# EAGLE design SEQ (EAGLE 9.6.2)

## Sheet 1 of 3: SEQ_microcontrolleur
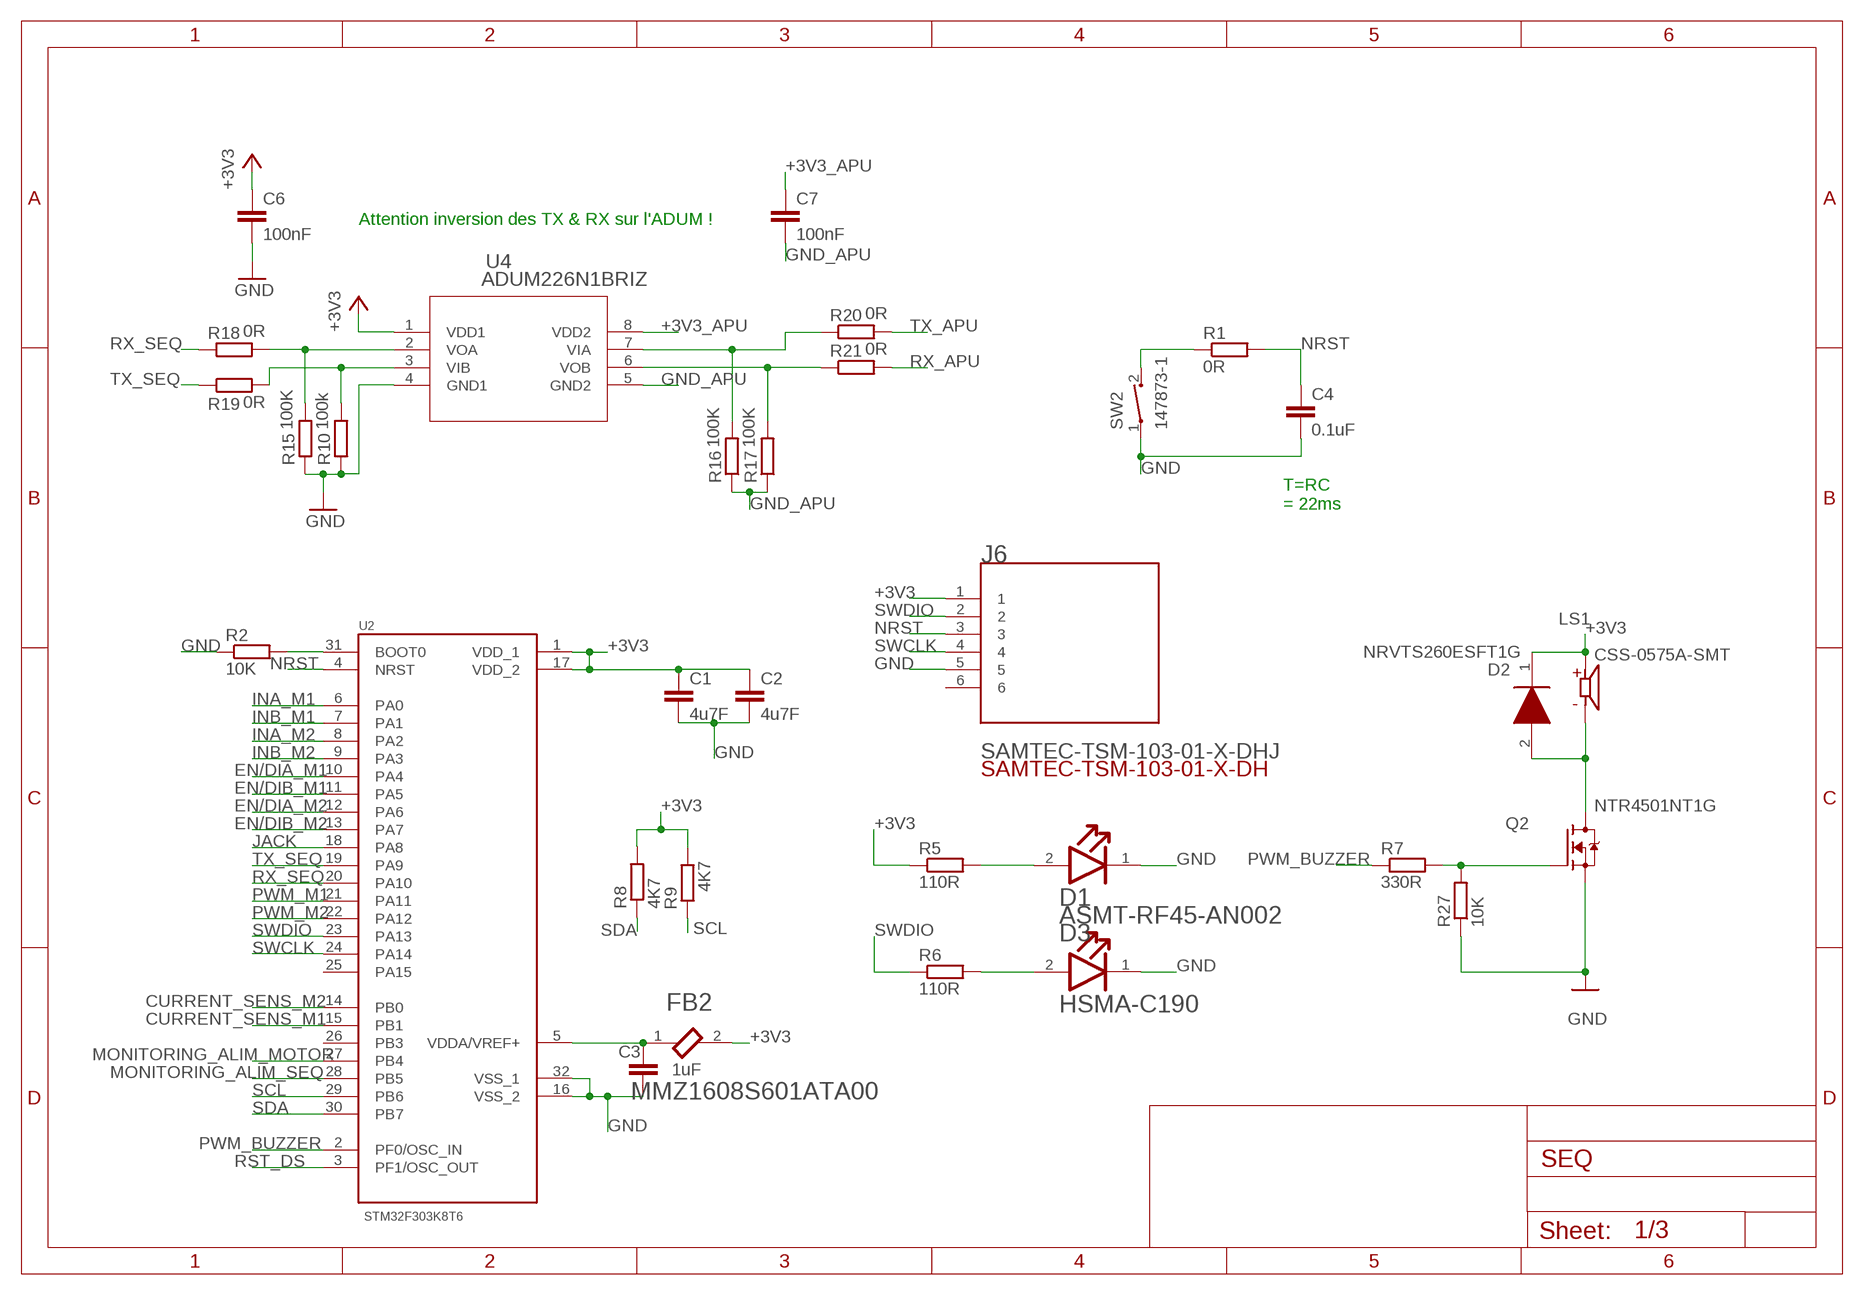
[diagram p0: schematic, sheet 1]

### Parts
C1  4u7F  C-EUC0805K  [C0805K]
C2  4u7F  C-EUC0805K  [C0805K]
C3  1uF  C-EUC0805K  [C0805K]
C4  0.1uF  C-EUC0805K  [C0805K]
C6  100nF  C-EUC0805  [C0805]
C7  100nF  C-EUC0805  [C0805]
D1  BROADCOM_ASMT-RF45-AN002BROADCOM_ASMT-RF45-AN002_0_0  [BROADCOM_ASMT-RF45-AN002_0]
D2  NRVTS260ESFT1G  [SODFL3616X98N]
D3  BROADCOM_HSMA-C190BROADCOM_HSMA-C190_0_0  [BROADCOM_HSMA-C190_0]
FB2  TDK_MMZ1608S601ATA00TDK_MMZ1608S601ATA00_0_0  [TDK_MMZ1608S601ATA00_0]
J6  SAMTEC-TSM-103-01-X-DHJ  [SAMTEC-TSM-103-01-X-DH]
LS1  CSS-0575A-SMT  [CUI_CSS-0575A-SMT]
Q2  NTR4501NT1G  [SOT95P237X111-3N]
R1  0R  R-EU_R0603  [R0603]
R2  10K  R-EU_R0603  [R0603]
R5  110R  R-EU_R0603  [R0603]
R6  110R  R-EU_R0603  [R0603]
R7  330R  R-EU_R0603  [R0603]
R8  4K7  R-EU_R0603  [R0603]
R9  4K7  R-EU_R0603  [R0603]
R10  100k  R-EU_R0603  [R0603]
R15  100K  R-EU_R0603  [R0603]
R16  100K  R-EU_R0603  [R0603]
R17  100K  R-EU_R0603  [R0603]
R18  0R  R-EU_R0603  [R0603]
R19  0R  R-EU_R0603  [R0603]
R20  0R  R-EU_R0603  [R0603]
R21  0R  R-EU_R0603  [R0603]
R27  10K  R-EU_R0603  [R0603]
SW2  147873-1  [SW_147873-1]
U2  STM32F303K8T6  [QFP80P900X900X160-32N]
U4  ADUM226N1BRIZ  [RI_8_1_ADI]

### Nets
+3V3: C1.1 C2.1 C6.1 D2.1(K) FB2.2 J6.1 LS1.1(P) R5.1 R8.2 R9.2 U2.1(VDD_1) U2.17(VDD_2) U4.1(VDD1) ; also sheet 2,3
+3V3_APU [Power]: C7.1 U4.8(VDD2) ; also sheet 3
CURRENT_SENS_M1: U2.15(PB1) ; also sheet 3
CURRENT_SENS_M2: U2.14(PB0) ; also sheet 3
EN/DIA_M1: U2.10(PA4) ; also sheet 3
EN/DIA_M2: U2.12(PA6) ; also sheet 3
EN/DIB_M1: U2.11(PA5) ; also sheet 3
EN/DIB_M2: U2.13(PA7) ; also sheet 3
GATE: Q2.1(G) R7.2 R27.2
GND: C1.2 C2.2 C3.2 C4.2 C6.2 D1.1(CATHODE) D3.1(CATHODE) J6.5 Q2.2(S) R2.1 R10.1 R15.1 R27.1 SW2.1 U2.16(VSS_2) U2.32(VSS_1) U4.4(GND1) ; also sheet 2,3
GND_APU: C7.2 R16.1 R17.1 U4.5(GND2) ; also sheet 2,3
INA_M1: U2.6(PA0) ; also sheet 3
INA_M2: U2.8(PA2) ; also sheet 3
INB_M1: U2.7(PA1) ; also sheet 3
INB_M2: U2.9(PA3) ; also sheet 3
JACK: U2.18(PA8) ; also sheet 3
MONITORING_ALIM_MOTOR: U2.27(PB4) ; also sheet 3
MONITORING_ALIM_SEQ: U2.28(PB5) ; also sheet 3
N$3 [Power]: C3.1 FB2.1 U2.5(VDDA/VREF+)
N$4: R2.2 U2.31(BOOT0)
N$6: R1.1 SW2.2
N$7: D1.2(ANODE) R5.2
N$9: D3.2(ANODE) R6.2
N$12 [50Ohms]: R10.2 R19.2 U4.3(VIB)
N$13 [50Ohms]: R15.2 R18.2 U4.2(VOA)
N$14 [50Ohms]: R16.2 R20.1 U4.7(VIA)
N$15 [50Ohms]: R17.2 R21.1 U4.6(VOB)
N$57: D2.2(A) LS1.2(N) Q2.3(D)
NRST: C4.1 J6.3 R1.2 U2.4(NRST)
PWM_BUZZER: R7.1 U2.2(PF0/OSC_IN)
PWM_M1: U2.21(PA11) ; also sheet 3
PWM_M2: U2.22(PA12) ; also sheet 3
RST_DS: U2.3(PF1/OSC_OUT) ; also sheet 2
RX_APU [50Ohms]: R21.2 ; also sheet 2,3
RX_SEQ [50Ohms]: R18.1 U2.20(PA10) ; also sheet 2
SCL [50Ohms]: R9.1 U2.29(PB6) ; also sheet 2,3
SDA [50Ohms]: R8.1 U2.30(PB7) ; also sheet 2,3
SWCLK [50Ohms]: J6.4 U2.24(PA14)
SWDIO [50Ohms]: J6.2 R6.1 U2.23(PA13)
TX_APU [50Ohms]: R20.2 ; also sheet 2,3
TX_SEQ [50Ohms]: R19.1 U2.19(PA9) ; also sheet 2
Unconnected: J6.6 U2.25(PA15) U2.26(PB3)

### Notes on the sheet
- Attention inversion des TX & RX sur l'ADUM !
- T=RC
  = 22ms

## Sheet 2 of 3: SEQ_capteur
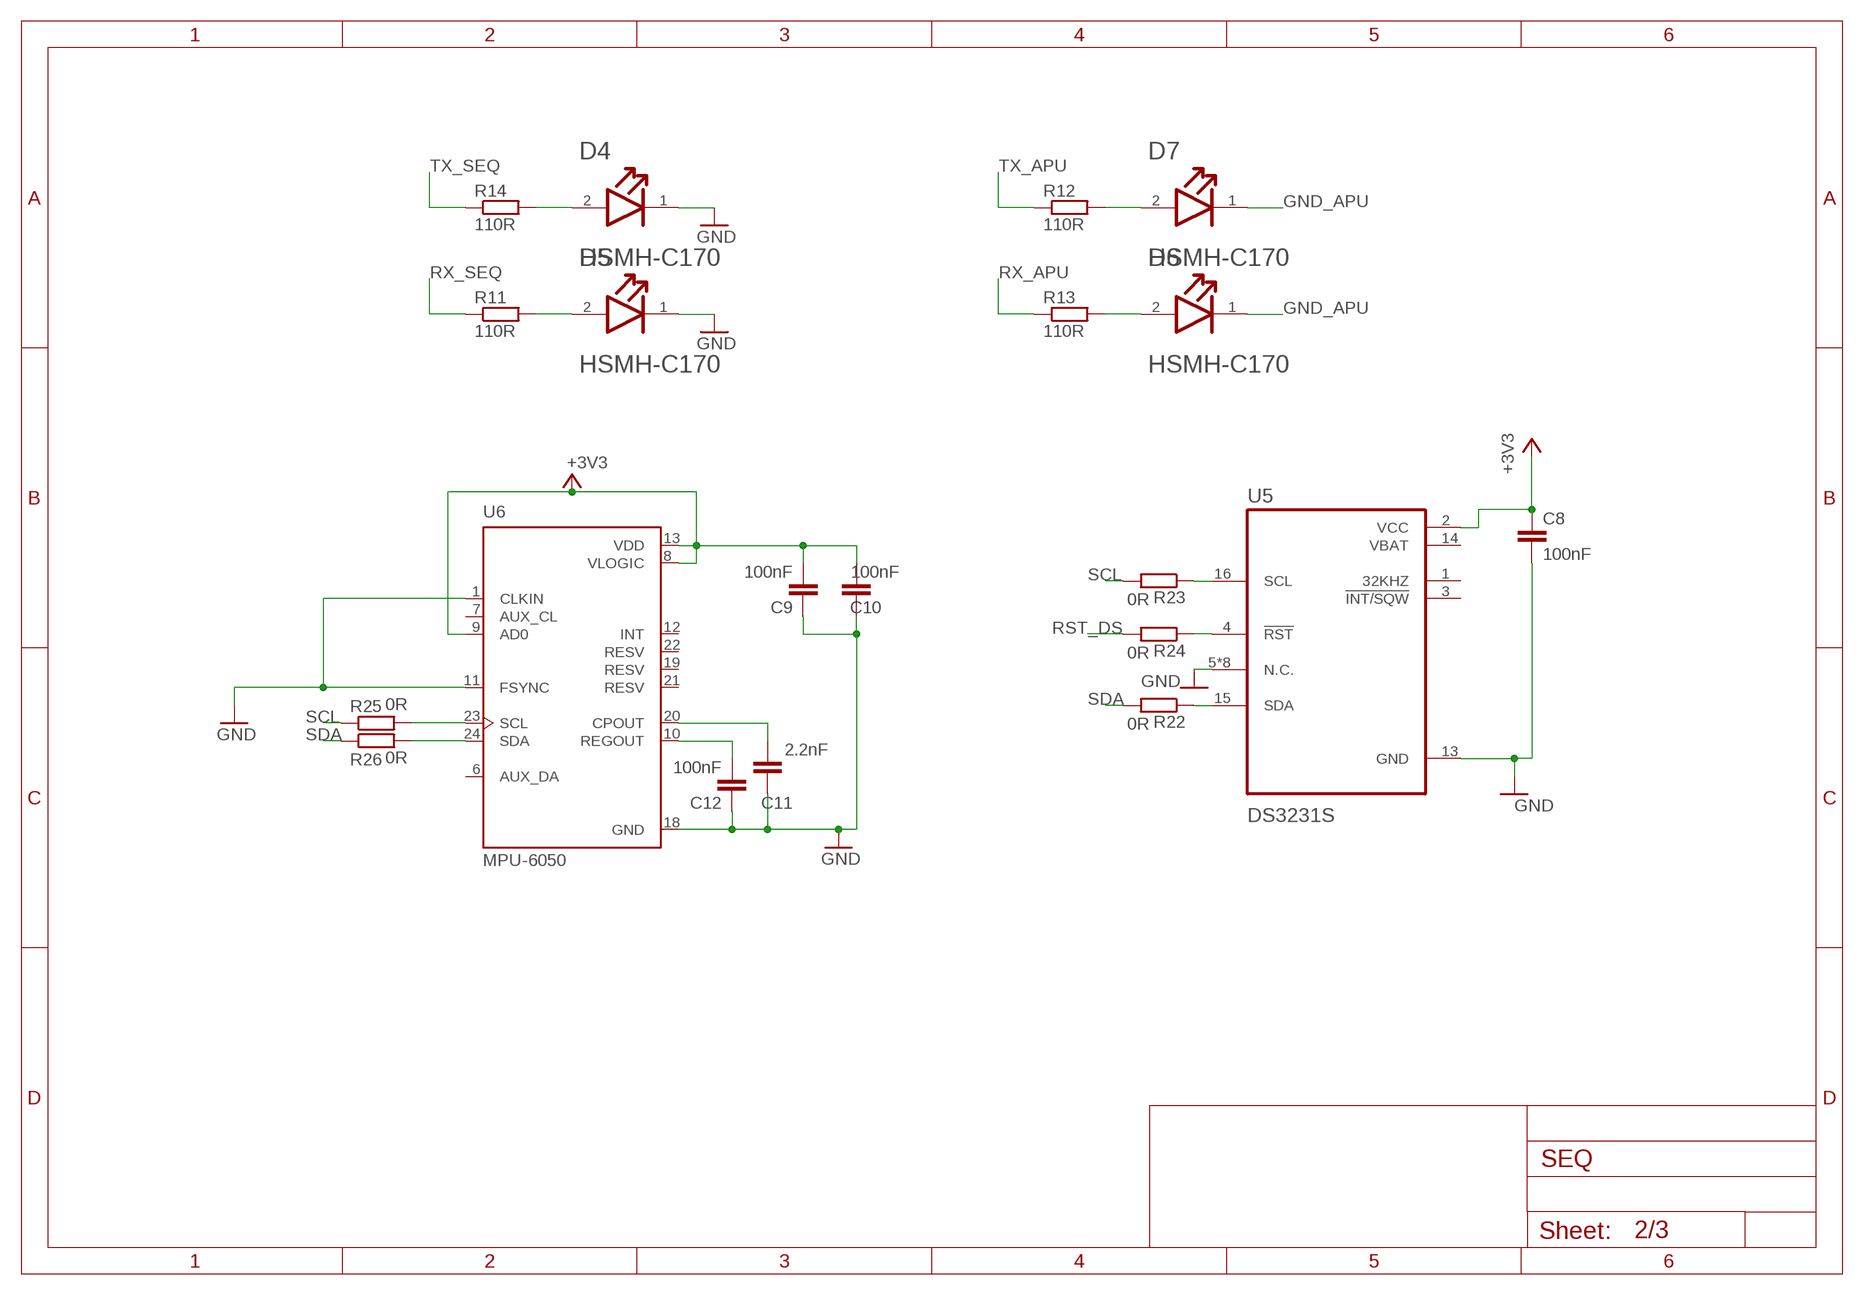
[diagram p1: schematic, sheet 2]

### Parts
C8  100nF  C-EUC0805  [C0805]
C9  100nF  C-EUC0805  [C0805]
C10  100nF  C-EUC0805  [C0805]
C11  2.2nF  C-EUC0805  [C0805]
C12  100nF  C-EUC0805  [C0805]
D4  BROADCOM_HSMH-C170BROADCOM_HSMH-C170_0_0  [BROADCOM_HSMH-C170_0]
D5  BROADCOM_HSMH-C170BROADCOM_HSMH-C170_0_0  [BROADCOM_HSMH-C170_0]
D6  BROADCOM_HSMH-C170BROADCOM_HSMH-C170_0_0  [BROADCOM_HSMH-C170_0]
D7  BROADCOM_HSMH-C170BROADCOM_HSMH-C170_0_0  [BROADCOM_HSMH-C170_0]
R11  110R  R-EU_R0603  [R0603]
R12  110R  R-EU_R0603  [R0603]
R13  110R  R-EU_R0603  [R0603]
R14  110R  R-EU_R0603  [R0603]
R22  0R  R-EU_R0603  [R0603]
R23  0R  R-EU_R0603  [R0603]
R24  0R  R-EU_R0603  [R0603]
R25  0R  R-EU_R0603  [R0603]
R26  0R  R-EU_R0603  [R0603]
U5  DS3231S  [SOIC127P1032X265-16N]
U6  MPU-6050  [QFN50P400X400X95-24N]

### Nets
+3V3: C8.1 C9.2 C10.2 U5.2(VCC) U6.8(VLOGIC) U6.9(AD0) U6.13(VDD) ; also sheet 1,3
GND: C8.2 C9.1 C10.1 C11.1 C12.1 D4.1(CATHODE) D5.1(CATHODE) U5.5(N.C.) U5.6(N.C.) U5.7(N.C.) U5.8(N.C.) U5.9(N.C.) U5.10(N.C.) U5.11(N.C.) U5.12(N.C.) U5.13(GND) U6.1(CLKIN) U6.11(FSYNC) U6.18(GND) ; also sheet 1,3
GND_APU: D6.1(CATHODE) D7.1(CATHODE) ; also sheet 1,3
N$1: D4.2(ANODE) R14.2
N$2: D5.2(ANODE) R11.2
N$8: D7.2(ANODE) R12.2
N$10: D6.2(ANODE) R13.2
N$16 [50Ohms]: R22.1 U5.15(SDA)
N$17 [50Ohms]: R23.1 U5.16(SCL)
N$18: R24.1 U5.4(!RST)
N$19 [50Ohms]: R26.2 U6.24(SDA)
N$20 [50Ohms]: R25.2 U6.23(SCL)
N$21: C12.2 U6.10(REGOUT)
N$22: C11.2 U6.20(CPOUT)
RST_DS: R24.2 ; also sheet 1
RX_APU [50Ohms]: R13.1 ; also sheet 1,3
RX_SEQ [50Ohms]: R11.1 ; also sheet 1
SCL [50Ohms]: R23.2 R25.1 ; also sheet 1,3
SDA [50Ohms]: R22.2 R26.1 ; also sheet 1,3
TX_APU [50Ohms]: R12.1 ; also sheet 1,3
TX_SEQ [50Ohms]: R14.1 ; also sheet 1
Unconnected: U5.1(32KHZ) U5.3(!INT/SQW) U6.6(AUX_DA) U6.7(AUX_CL) U6.12(INT) U6.19(RESV) U6.21(RESV) U6.22(RESV)

## Sheet 3 of 3: SEQ_connecteur
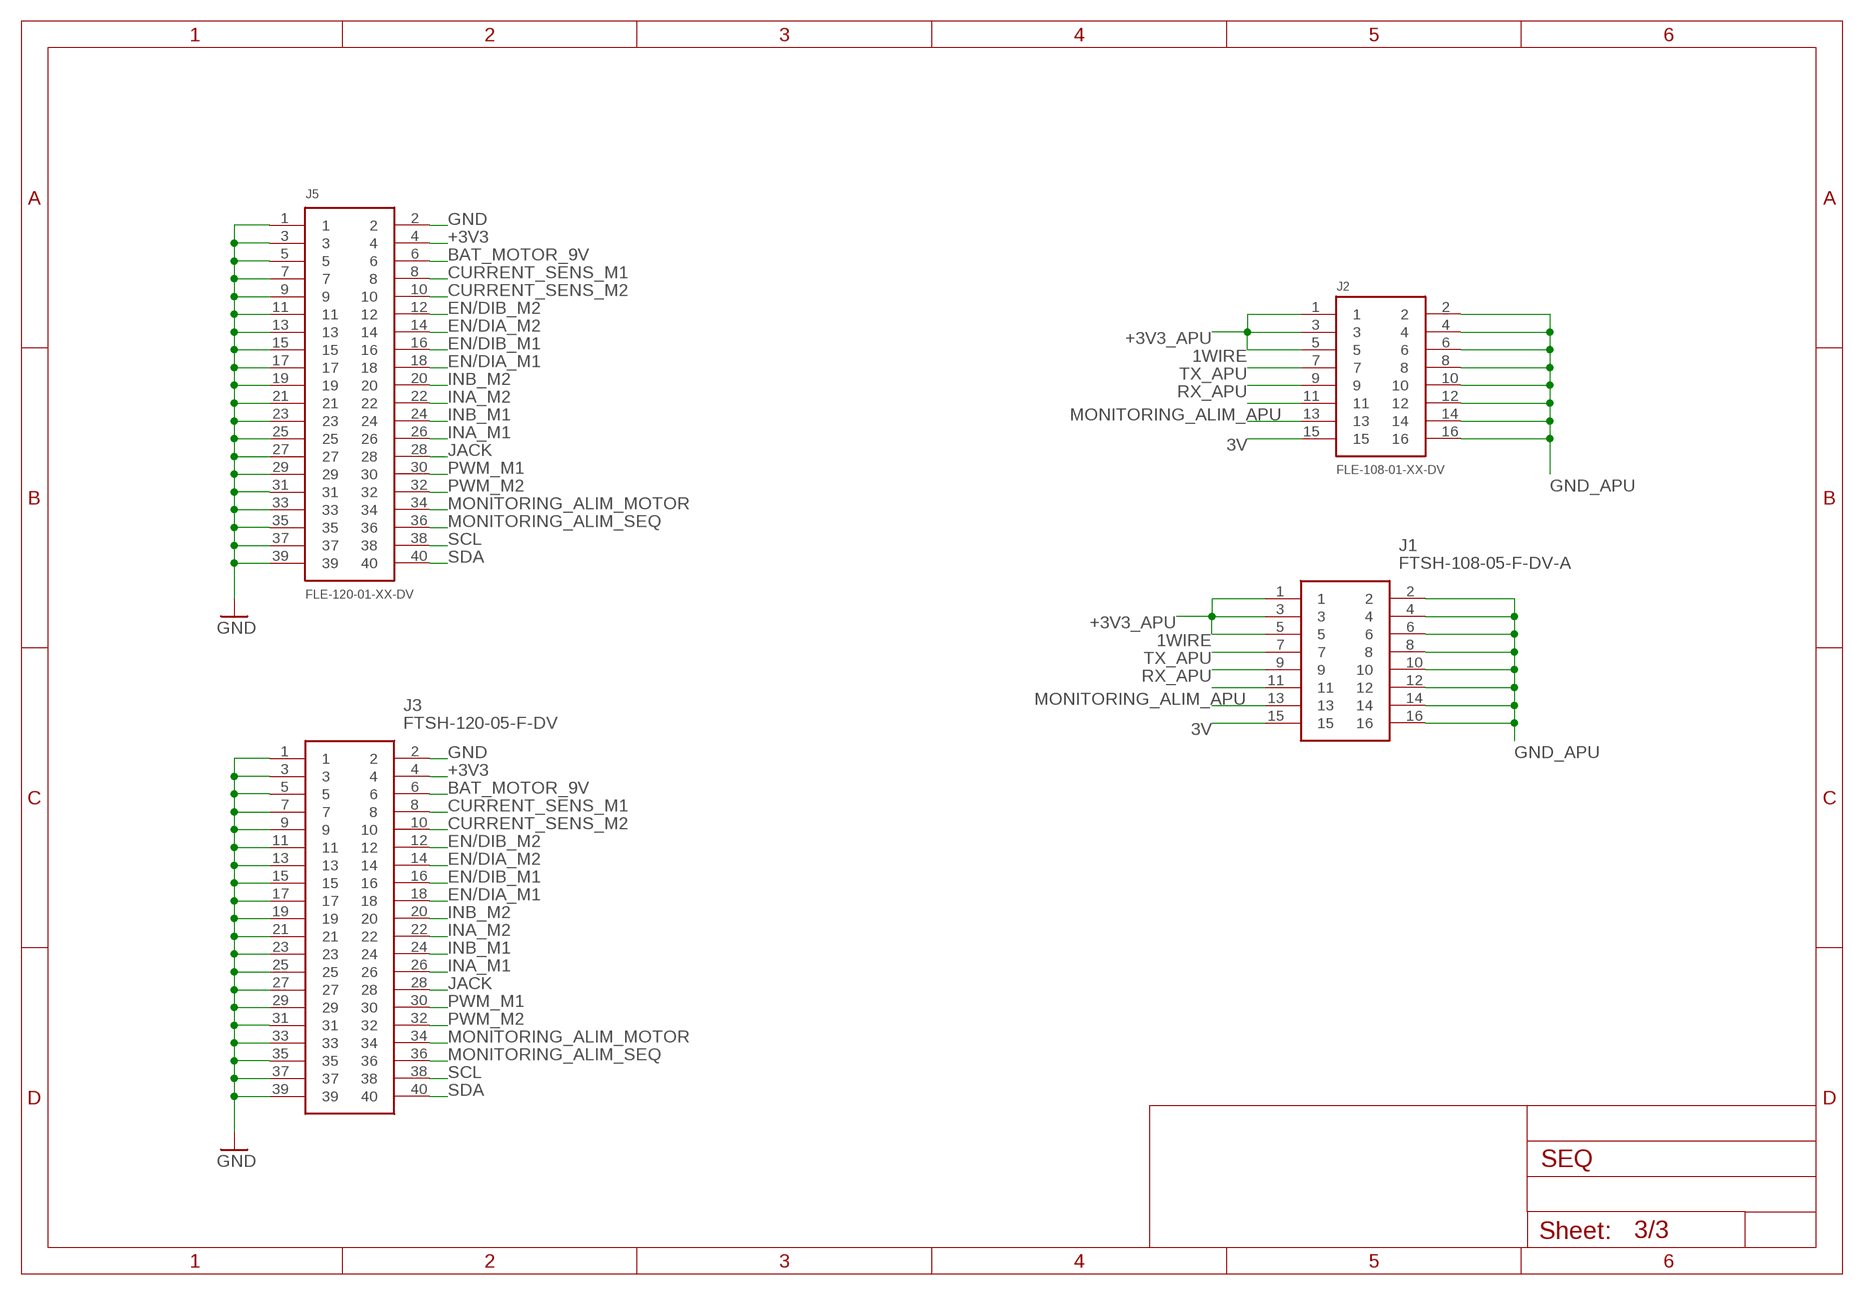
[diagram p2: schematic, sheet 3]

### Parts
J1  FTSH-108-05-F-DV-A  [FTSH-108-XX-YYY-DV-A]
J2  FLE-108-01-XX-DV  [FLE-108-01-XX-DV]
J3  FTSH-120-05-F-DV  [FTSH-120-XX-YYY-DV]
J5  FLE-120-01-XX-DV  [FLE-120-01-XX-DV]

### Nets
1WIRE: J1.7 J2.7
3V: J1.15 J2.15
+3V3: J3.4 J5.4 ; also sheet 1,2
+3V3_APU [Power]: J1.1 J1.3 J1.5 J2.1 J2.3 J2.5 ; also sheet 1
BAT_MOTOR_9V [Power]: J3.6 J5.6
CURRENT_SENS_M1: J3.8 J5.8 ; also sheet 1
CURRENT_SENS_M2: J3.10 J5.10 ; also sheet 1
EN/DIA_M1: J3.18 J5.18 ; also sheet 1
EN/DIA_M2: J3.14 J5.14 ; also sheet 1
EN/DIB_M1: J3.16 J5.16 ; also sheet 1
EN/DIB_M2: J3.12 J5.12 ; also sheet 1
GND: J3.1 J3.2 J3.3 J3.5 J3.7 J3.9 J3.11 J3.13 J3.15 J3.17 J3.19 J3.21 J3.23 J3.25 J3.27 J3.29 J3.31 J3.33 J3.35 J3.37 J3.39 J5.1 J5.2 J5.3 J5.5 J5.7 J5.9 J5.11 J5.13 J5.15 J5.17 J5.19 J5.21 J5.23 J5.25 J5.27 J5.29 J5.31 J5.33 J5.35 J5.37 J5.39 ; also sheet 1,2
GND_APU: J1.2 J1.4 J1.6 J1.8 J1.10 J1.12 J1.14 J1.16 J2.2 J2.4 J2.6 J2.8 J2.10 J2.12 J2.14 J2.16 ; also sheet 1,2
INA_M1: J3.26 J5.26 ; also sheet 1
INA_M2: J3.22 J5.22 ; also sheet 1
INB_M1: J3.24 J5.24 ; also sheet 1
INB_M2: J3.20 J5.20 ; also sheet 1
JACK: J3.28 J5.28 ; also sheet 1
MONITORING_ALIM_APU: J1.13 J2.13
MONITORING_ALIM_MOTOR: J3.34 J5.34 ; also sheet 1
MONITORING_ALIM_SEQ: J3.36 J5.36 ; also sheet 1
PWM_M1: J3.30 J5.30 ; also sheet 1
PWM_M2: J3.32 J5.32 ; also sheet 1
RX_APU [50Ohms]: J1.11 J2.11 ; also sheet 1,2
SCL [50Ohms]: J3.38 J5.38 ; also sheet 1,2
SDA [50Ohms]: J3.40 J5.40 ; also sheet 1,2
TX_APU [50Ohms]: J1.9 J2.9 ; also sheet 1,2

## Power pins joined to a net without a drawn wire
VBAT: U5.14(VBAT)

## Library data of the parts
C1-C4 C6-C12 = rcl:C-EU: CAPACITOR, European symbol; SPICEPREFIX: C
D1 = Broadcom - ASMT-RF45-AN002:BROADCOM_ASMT-RF45-AN002: LED YLW/GREEN DIFFUSED 0603 SMD; AUTOMOTIVE: No; CENTROID_NOT_SPECIFIED: No; COLOUR: Yellow Green; DATASHEET: https://docs.broadcom.com/docs/AV02-0378EN; DEVICE_CLASS_L1: Optoelectronics; DEVICE_CLASS_L2: LEDs; DEVICE_CLASS_L3: unset; DIGIKEY_DESCRIPTION: DIODE LED YLW/GREEN DIFFUSED 0603 SMD; DIGIKEY_PART_NUMBER: 516-2522-1-ND; FOOTPRINT_VARIANT_NAME_0: Recommended_Land_Pattern; FORWARD_CURRENT: 20mA; FORWARD_VOLTAGE: 2V; HEIGHT: 0.55mm; LEAD_FREE: Yes; LED_ORIENTATION: Top View; LUMINOUS_INTENSITY: 60mcd; MAX_JUNCTION_TEMP: +110°C; MF: Broadcom; MFG_PACKAGE_IDENT: ASMT-RF45-AN002; MFG_PACKAGE_IDENT_DATE: 0; MFG_PACKAGE_IDENT_REV: 0; MOUSER_DESCRIPTION: LED; SMD; 0603; yellow green; 28-60mcd; 1.6x0.8x0.45mm; 145°; 20mA; MOUSER_PART_NUMBER: 630-ASMT-RF45-AN002; MPN: ASMT-RF45-AN002; PACKAGE: SMD2; PEAK_EMMISION_WAVELENGTH: 574nm; POWER_DISSIPATION: 48mW; PREFIX: D; REVERSE_VOLTAGE: 5V; ROHS: Yes; TEMPERATURE_RANGE_HIGH: +100°C; TEMPERATURE_RANGE_LOW: -40°C; VERIFICATION_VERSION: 0.0.0.3; VIEWING_ANGLE: 145°; WAVELENGTH: 573nm
D2 = NRVTS260ESFT1G:NRVTS260ESFT1G: Very Low Forward Voltage Trench-based Schottky Rectifier Source: Datasheet <http://www.onsemi.com/pub/Collateral/NTS260ESF-D.PDF>; ARROW_PART_NUMBER: NRVTS260ESFT1G; ARROW_PRICE-STOCK: https://www.arrow.com/en/products/nrvts260esft1g/on-semiconductor; DESCRIPTION: Very Low Forward Voltage Trench-based Schottky Rectifier; HEIGHT: 0.98mm; MANUFACTURER_NAME: ON Semiconductor; MANUFACTURER_PART_NUMBER: NRVTS260ESFT1G; MOUSER_PART_NUMBER: 863-NRVTS260ESFT1G; MOUSER_PRICE-STOCK: https://www.mouser.co.uk/ProductDetail/ON-Semiconductor/NRVTS260ESFT1G?qs=k6dkFvHqcvDSiGC4Em3TUg%3D%3D
D3 = Broadcom - HSMA-C190:BROADCOM_HSMA-C190: Amber 592nm LED Indication - Discrete 1.9V 0603 (1608 Metric); AUTOMOTIVE: No; CENTROID_NOT_SPECIFIED: No; COLOUR: Amber; DATASHEET: https://docs.broadcom.com/doc/AV02-0112EN; DEVICE_CLASS_L1: Optoelectronics; DEVICE_CLASS_L2: LEDs; DEVICE_CLASS_L3: unset; DIGIKEY_DESCRIPTION: LED AMBER DIFFUSED CHIP SMD; DIGIKEY_PART_NUMBER: 516-1423-1-ND; FOOTPRINT_VARIANT_NAME_0: Recommended_Land_Pattern; FORWARD_CURRENT: 20mA; FORWARD_VOLTAGE: 1.9V; HEIGHT: 0.9mm; LEAD_FREE: Yes; LED_ORIENTATION: Top View; LUMINOUS_INTENSITY: 90mcd; MAX_JUNCTION_TEMP: +95°C; MF: Broadcom; MFG_PACKAGE_IDENT: 0; MFG_PACKAGE_IDENT_DATE: 0; MFG_PACKAGE_IDENT_REV: 0; MOUSER_DESCRIPTION: LED Uni-Color Amber 595nm 2-Pin Chip LED T/R; MOUSER_PART_NUMBER: 630-HSMA-C190; MPN: HSMA-C190; PACKAGE: 0603; PEAK_EMMISION_WAVELENGTH: 595nm; POWER_DISSIPATION: 60mW; PREFIX: D; REVERSE_VOLTAGE: 5V; ROHS: Yes; TEMPERATURE_RANGE_HIGH: +85°C; TEMPERATURE_RANGE_LOW: -40°C; VERIFICATION_VERSION: 0.0.0.3; VIEWING_ANGLE: 170°; VOLTAGE: 1.9V; WAVELENGTH: 592nm
D4-D7 = Broadcom - HSMH-C170:BROADCOM_HSMH-C170: LED RED DIFFUSED 0805 SMD; CENTROID_NOT_SPECIFIED: No; COLOUR: Red; DATASHEET: https://media.digikey.com/pdf/Data%20Sheets/Avago%20PDFs/HSMz-Czzz.pdf; DEVICE_CLASS_L1: Optoelectronics; DEVICE_CLASS_L2: LEDs; DEVICE_CLASS_L3: unset; DIGIKEY_DESCRIPTION: DIODE LED RED DIFFUSED 0805 SMD; DIGIKEY_PART_NUMBER: 516-1427-1-ND; FORWARD_CURRENT: 25mA; FORWARD_VOLTAGE: 1.8V; HEIGHT: 0.9mm; LEAD_FREE: yes; LED_ORIENTATION: Top View; LUMINOUS_INTENSITY: 17mcd; MAX_JUNCTION_TEMP: +95°C; MF: Broadcom; MFG_PACKAGE_IDENT: HSMH-C170; MFG_PACKAGE_IDENT_DATE: 0; MFG_PACKAGE_IDENT_REV: 0; MOUSER_PART_NUMBER: 630-HSMH-C170; MPN: HSMH-C170; PACKAGE: 0805 (2012 metric); POWER_DISSIPATION: 65mW; PREFIX: D; REVERSE_VOLTAGE: 5V; ROHS: yes; STANDOFF_HEIGHT: 0mm; TEMPERATURE_RANGE_HIGH: +85°C; TEMPERATURE_RANGE_LOW: -40°C; VERIFICATION_VERSION: 0.0.0.1; VIEWING_ANGLE: 170°; WAVELENGTH: 639nm
FB2 = TDK - MMZ1608S601ATA00:TDK_MMZ1608S601ATA00: Signal Line Ferrite Bead 600Ω @ 100MHz 500mA DCR 350mΩ SMD 0603; AUTOMOTIVE: No; CENTROID_NOT_SPECIFIED: No; CORE_MATERIAL: Ferrite; DATASHEET: https://product.tdk.com/en/search/emc/emc/beads/info?part_no=MMZ1608S601ATA00; DEVICE_CLASS_L1: Passive Components; DEVICE_CLASS_L2: EMI / RFI Components; DEVICE_CLASS_L3: Ferrite Beads and Chips; FOOTPRINT_PARAMETERS_1: {"fp_type":"chip_res","params":{"L":{"nom":1600000,"long name":"Length","min":1450000,"max":1750000,"short name":"L","type":"measurement"},"W":{"nom":800000,"long name":"Width","min":650000,"max":950000,"short name":"W","type":"measurement"},"t":{"nom":800000,"long name":"Height","min":650000,"max":950000,"short name":"t","type":"measurement"},"b":{"nom":300000,"long name":"Terminal width","min":100000,"max":500000,"short name":"b","type":"measurement"},"P":{"default":"false","long name":"Polarized","type":"multichoice","short name":"P"},"offset x":{"nom":0,"long name":"X Center offset","min":null,"max":null,"short name":"offset x","type":"measurement"},"offset y":{"nom":0,"long name":"Y Center offset","min":null,"max":null,"short name":"offset y","type":"measurement"},"LS":{"long name":"Land shape","type":"fixed","short name":"LS","value":"Rectangle"},"solder toe":{"nom":550000,"long name":"Solder fillet (toe)","min":null,"max":null,"short name":"solder toe","type":"fixedmeasurement"},"solder heel":{"nom":0,"long name":"Solder fillet (heel)","min":null,"max":null,"short name":"solder heel","type":"fixedmeasurement"},"solder side":{"nom":50000,"long name":"Solder fillet (side)","min":null,"max":null,"short name":"solder side","type":"fixedmeasurement"},"courtyard":{"nom":500000,"long name":"Courtyard","min":null,"max":null,"short name":"courtyard","type":"fixedmeasurement"},"SF":{"default":"A (>= 1608 metric)","long name":"Packing level","type":"multichoiceparent","short name":"SF","help":"http://support.upverter.com/customer/portal/articles/978783-what-is-a-footprint-packing-level","children":["solder toe","solder heel","solder side","courtyard"]}}}; FOOTPRINT_PARAMETERS_2: {"fp_type":"chip_res","params":{"L":{"nom":1600000,"long name":"Length","min":1450000,"max":1750000,"short name":"L","type":"measurement"},"W":{"nom":800000,"long name":"Width","min":650000,"max":950000,"short name":"W","type":"measurement"},"t":{"nom":800000,"long name":"Height","min":650000,"max":950000,"short name":"t","type":"measurement"},"b":{"nom":300000,"long name":"Terminal width","min":100000,"max":500000,"short name":"b","type":"measurement"},"P":{"default":"false","long name":"Polarized","type":"multichoice","short name":"P"},"offset x":{"nom":0,"long name":"X Center offset","min":null,"max":null,"short name":"offset x","type":"measurement"},"offset y":{"nom":0,"long name":"Y Center offset","min":null,"max":null,"short name":"offset y","type":"measurement"},"LS":{"long name":"Land shape","type":"fixed","short name":"LS","value":"Rectangle"},"solder toe":{"nom":350000,"long name":"Solder fillet (toe)","min":null,"max":null,"short name":"solder toe","type":"fixedmeasurement"},"solder heel":{"nom":0,"long name":"Solder fillet (heel)","min":null,"max":null,"short name":"solder heel","type":"fixedmeasurement"},"solder side":{"nom":0,"long name":"Solder fillet (side)","min":null,"max":null,"short name":"solder side","type":"fixedmeasurement"},"courtyard":{"nom":250000,"long name":"Courtyard","min":null,"max":null,"short name":"courtyard","type":"fixedmeasurement"},"SF":{"default":"B (>= 1608 metric)","long name":"Packing level","type":"multichoiceparent","short name":"SF","help":"http://support.upverter.com/customer/portal/articles/978783-what-is-a-footprint-packing-level","children":["solder toe","solder heel","solder side","courtyard"]}}}; FOOTPRINT_PARAMETERS_3: {"fp_type":"chip_res","params":{"L":{"nom":1600000,"long name":"Length","min":1450000,"max":1750000,"short name":"L","type":"measurement"},"W":{"nom":800000,"long name":"Width","min":650000,"max":950000,"short name":"W","type":"measurement"},"t":{"nom":800000,"long name":"Height","min":650000,"max":950000,"short name":"t","type":"measurement"},"b":{"nom":300000,"long name":"Terminal width","min":100000,"max":500000,"short name":"b","type":"measurement"},"P":{"default":"false","long name":"Polarized","type":"multichoice","short name":"P"},"offset x":{"nom":0,"long name":"X Center offset","min":null,"max":null,"short name":"offset x","type":"measurement"},"offset y":{"nom":0,"long name":"Y Center offset","min":null,"max":null,"short name":"offset y","type":"measurement"},"LS":{"long name":"Land shape","type":"fixed","short name":"LS","value":"Rectangle"},"solder toe":{"nom":150000,"long name":"Solder fillet (toe)","min":null,"max":null,"short name":"solder toe","type":"fixedmeasurement"},"solder heel":{"nom":0,"long name":"Solder fillet (heel)","min":null,"max":null,"short name":"solder heel","type":"fixedmeasurement"},"solder side":{"nom":-50000,"long name":"Solder fillet (side)","min":null,"max":null,"short name":"solder side","type":"fixedmeasurement"},"courtyard":{"nom":100000,"long name":"Courtyard","min":null,"max":null,"short name":"courtyard","type":"fixedmeasurement"},"SF":{"default":"C (>= 1608 metric)","long name":"Packing level","type":"multichoiceparent","short name":"SF","help":"http://support.upverter.com/customer/portal/articles/978783-what-is-a-footprint-packing-level","children":["solder toe","solder heel","solder side","courtyard"]}}}; FOOTPRINT_VARIANT_NAME_0: Recommended_Land_Pattern; FOOTPRINT_VARIANT_NAME_1: IPC_A; FOOTPRINT_VARIANT_NAME_2: IPC_B; FOOTPRINT_VARIANT_NAME_3: IPC_C; HEIGHT: 0.95mm; IMPEDANCE_AT_FREQUENCY: 600Ω @ 100MHz; IPC_LAND_PATTERN_NAME: CAPC16080X80; LEAD_FREE: Yes; MF: TDK; MFG_PACKAGE_IDENT: MMZ1608-0.8; MFG_PACKAGE_IDENT_COMPONENT_ID: 6a9689a634049a42; MFG_PACKAGE_IDENT_DATE: 0; MFG_PACKAGE_IDENT_REV: 0; MPN: MMZ1608S601ATA00; PACKAGE: 0603; PREFIX: FB; RMS_CURRENT: 500mA; ROHS: Yes; SERIES_RESISTANCE: 350mΩ; TEMPERATURE_RANGE_HIGH: +125°C; TEMPERATURE_RANGE_LOW: -55°C; TEST_FREQUENCY: 100MHz; TOLERANCE: 25%; VERIFICATION_VERSION: 0.0.0.3
J1 = FTSH-108-05-F-DV-A:FTSH-108-05-F-DV-A: 16 Position, High Reliability Header Strips, 0.050" pitch Source: Datasheet <http://suddendocs.samtec.com/prints/ftsh-1xx-xx-xxx-dv-xxx-xxx-mkt.pdf>; ARROW_PART_NUMBER: FTSH-108-05-F-DV-A; ARROW_PRICE-STOCK: https://www.arrow.com/en/products/ftsh-108-05-f-dv-a/samtec; DESCRIPTION: 16 Position, High Reliability Header Strips, 0.050&quot; pitch; HEIGHT: mm; MANUFACTURER_NAME: SAMTEC; MANUFACTURER_PART_NUMBER: FTSH-108-05-F-DV-A; MOUSER_PART_NUMBER: 200-FTSH10805FDVA; MOUSER_PRICE-STOCK: https://www.mouser.co.uk/ProductDetail/Samtec/FTSH-108-05-F-DV-A?qs=PB6%2FjmICvI1admAR1gVHNg%3D%3D
J2 = FLE-108-01-XX-DV:FLE-108-01-XX-DV: DOUBLE ROW 0.050"X0.050" STRIP ASSEMBLY. Check prices <https://pricing.snapeda.com/parts/FLE-108-01-G-DV/Samtec/view-part?ref=eda>; AVAILABILITY: Bad; DESCRIPTION: 16 Position Receptacle Connector Surface Mount; MF: Samtec; MP: FLE-108-01-G-DV; PACKAGE: None; PRICE: None; PURCHASE-URL: https://pricing.snapeda.com/search/part/FLE-108-01-G-DV/?ref=eda
J3 = FTSH-120-05-F-DV:FTSH-120-05-F-DV: 40 Position, High Reliability Header Strips, 0.050" pitch Source: Datasheet <http://suddendocs.samtec.com/prints/ftsh-1xx-xx-xxx-dv-xxx-xxx-mkt.pdf>; DESCRIPTION: 40 Position, High Reliability Header Strips, 0.050&quot; pitch; HEIGHT: mm; MANUFACTURER_NAME: SAMTEC; MANUFACTURER_PART_NUMBER: FTSH-120-05-F-DV
J5 = FLE-120-01-XX-DV:FLE-120-01-XX-DV: DOUBLE ROW 0.050"X0.050" STRIP ASSEMBLY. Check prices <https://pricing.snapeda.com/parts/FLE-120-01-G-DV/Samtec/view-part?ref=eda>; AVAILABILITY: Bad; DESCRIPTION: 40 Position Receptacle Connector Surface Mount; MF: Samtec; MP: FLE-120-01-G-DV; PACKAGE: None; PRICE: None; PURCHASE-URL: https://pricing.snapeda.com/search/part/FLE-120-01-G-DV/?ref=eda
J6 = SAMTEC-TSM-103-01-X-DH:SAMTEC-TSM-103-01-X-DH: Check prices <https://pricing.snapeda.com/parts/TSM-103-01-F-DH/Samtec%20Inc./view-part?ref=eda>; AVAILABILITY: Bad; DESCRIPTION: Connector Header Surface Mount, Right Angle 6 position 0.100 (2.54mm); MF: Samtec Inc.; MP: TSM-103-01-F-DH; PACKAGE: None; PRICE: None; PURCHASE-URL: https://pricing.snapeda.com/search/part/TSM-103-01-F-DH/?ref=eda
LS1 = CUI_CSS-0575A-SMT:CSS-0575A-SMT: 5 mm, 3 V, 75 dB, Surface Mount (SMT), Magnetic Audio Transducer Buzzer; AVAILABILITY: Unavailable; DESCRIPTION: 5 mm, 3 V, 75 dB, Surface Mount _SMT_, Magnetic Audio Transducer Buzzer; MF: CUI; MP: CSS-0575A-SMT; PACKAGE: None; PRICE: None
Q2 = NTR4501NT1G:NTR4501NT1G: N-Channel 20V 3.2A (Ta) 1.25W (Tj) Surface Mount SOT-23-3 (TO-236) Check prices <https://pricing.snapeda.com/parts/NTR4501NT1G/ON%20Semiconductor/view-part?ref=eda>; AVAILABILITY: Good; DESCRIPTION: N-Channel 20V 3.2A (Ta) 1.25W (Tj) Surface Mount SOT-23-3 (TO-236); MF: ON Semiconductor; MP: NTR4501NT1G; PACKAGE: SOT-23-3 ON Semiconductor; PRICE: None; PURCHASE-URL: https://pricing.snapeda.com/search/part/NTR4501NT1G/?ref=eda
R1 R2 R5-R27 = rcl:R-EU_: RESISTOR, European symbol; SPICEPREFIX: R
SW2 = 147873-1:147873-1: Switch Tactile OFF (ON) SPST Rectangular Button J-Bend 0.05A 24VDC 1.77N SMD T/R Check prices <https://pricing.snapeda.com/parts/147873-1/TE%20Connectivity/view-part?ref=eda>; AVAILABILITY: Good; COMMENT: 147873-1; DESCRIPTION: Switch Tactile OFF (ON) SPST Rectangular Button J-Bend 0.05A 24VDC 1.77N SMD T/R; MF: TE Connectivity; MP: 147873-1; PACKAGE: None; PRICE: None; PURCHASE-URL: https://pricing.snapeda.com/search/part/147873-1/?ref=eda
U2 = STM32F303K8T6:STM32F303K8T6: Analog and DSP with FPU ARM Cortex-M4 MCU with 64 Kbytes Flash, 72 MHz CPU, CCM, 12-bit ADC 5 MSPS, comparators, op-amp; MANUFACTURER: ST microelectronics
U4 = ADUM226N1BRIZ:ADUM226N1BRIZ; BUILT_BY: Analog Devices Inc.; MANUFACTURER_PART_NUMBER: ADUM226N1BRIZ; SOURCELIBRARY: Analog_2018-03-03; VENDOR: Analog Devices Inc
U5 = DS3231S:DS3231S: Check prices <https://pricing.snapeda.com/parts/DS3231S/Maxim%20Integrated/view-part?ref=eda>; AVAILABILITY: Warning; DESCRIPTION: Real Time Clock (RTC) IC Clock/Calendar I²C, 2-Wire Serial 16-SOIC (0.295, 7.50mm Width); MF: Maxim Integrated; MP: DS3231S; PACKAGE: SOIC-16 Maxim Integrated; PRICE: None; PURCHASE-URL: https://pricing.snapeda.com/search/part/DS3231S/?ref=eda
U6 = MPU-6050:MPU-6050: MPU-6050 Six-Axis (Gyro + Accelerometer) MEMS MotionTracking™ Devices Check prices <https://pricing.snapeda.com/parts/MPU-6050/TDK%20InvenSense/view-part?ref=eda>; AVAILABILITY: Warning; DESCRIPTION: IMU ACCEL/GYRO 3-AXIS I2C 24QFN; MF: TDK InvenSense; MP: MPU-6050; PACKAGE: VFQFN-24 TDK InvenSense; PRICE: None; PURCHASE-URL: https://pricing.snapeda.com/search/part/MPU-6050/?ref=eda

## Net classes
0 default: width 0.2 mm, clearance 0.127 mm
1 Power: width 0.4 mm, clearance 0.2 mm
2 50Ohms: width 0.147 mm, clearance 0.127 mm

## Board
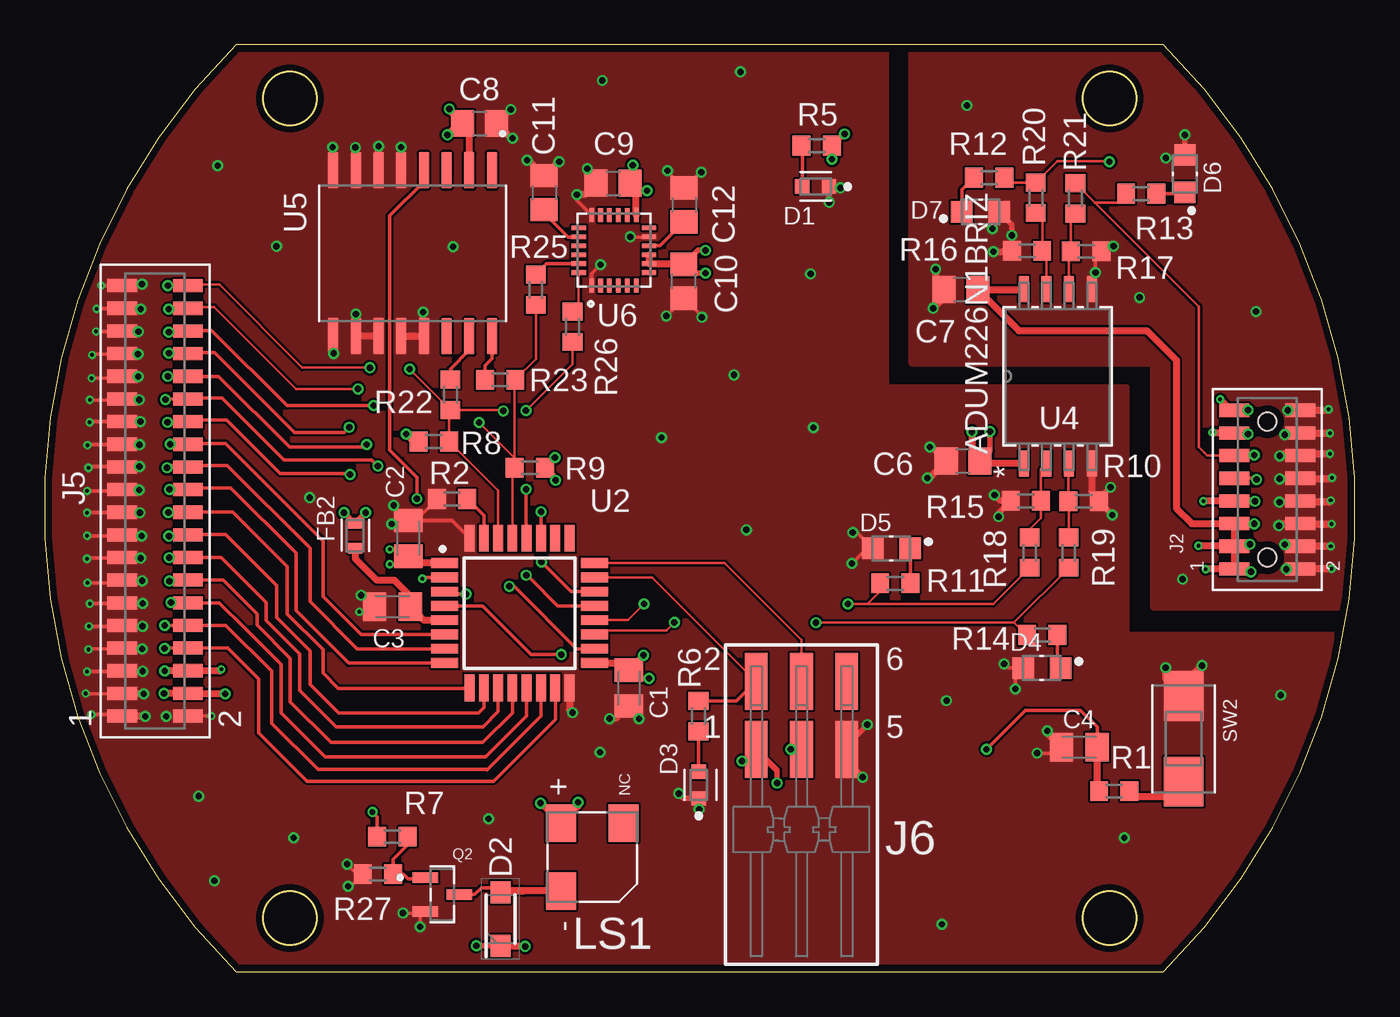
[diagram p3: board, top side]
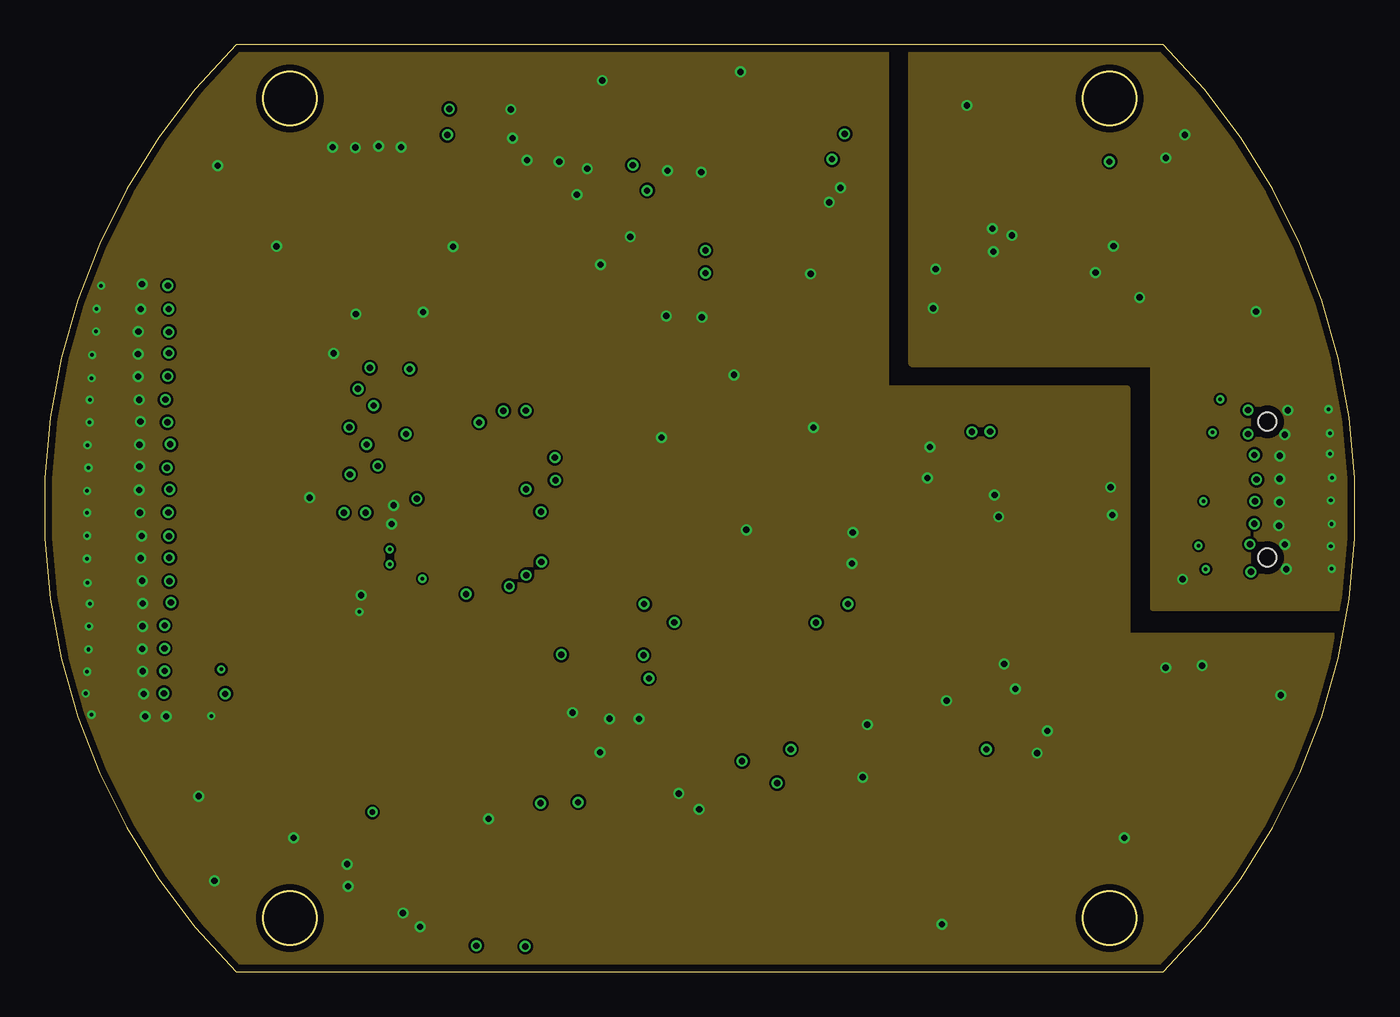
[diagram p4: board, inner layer Route2]
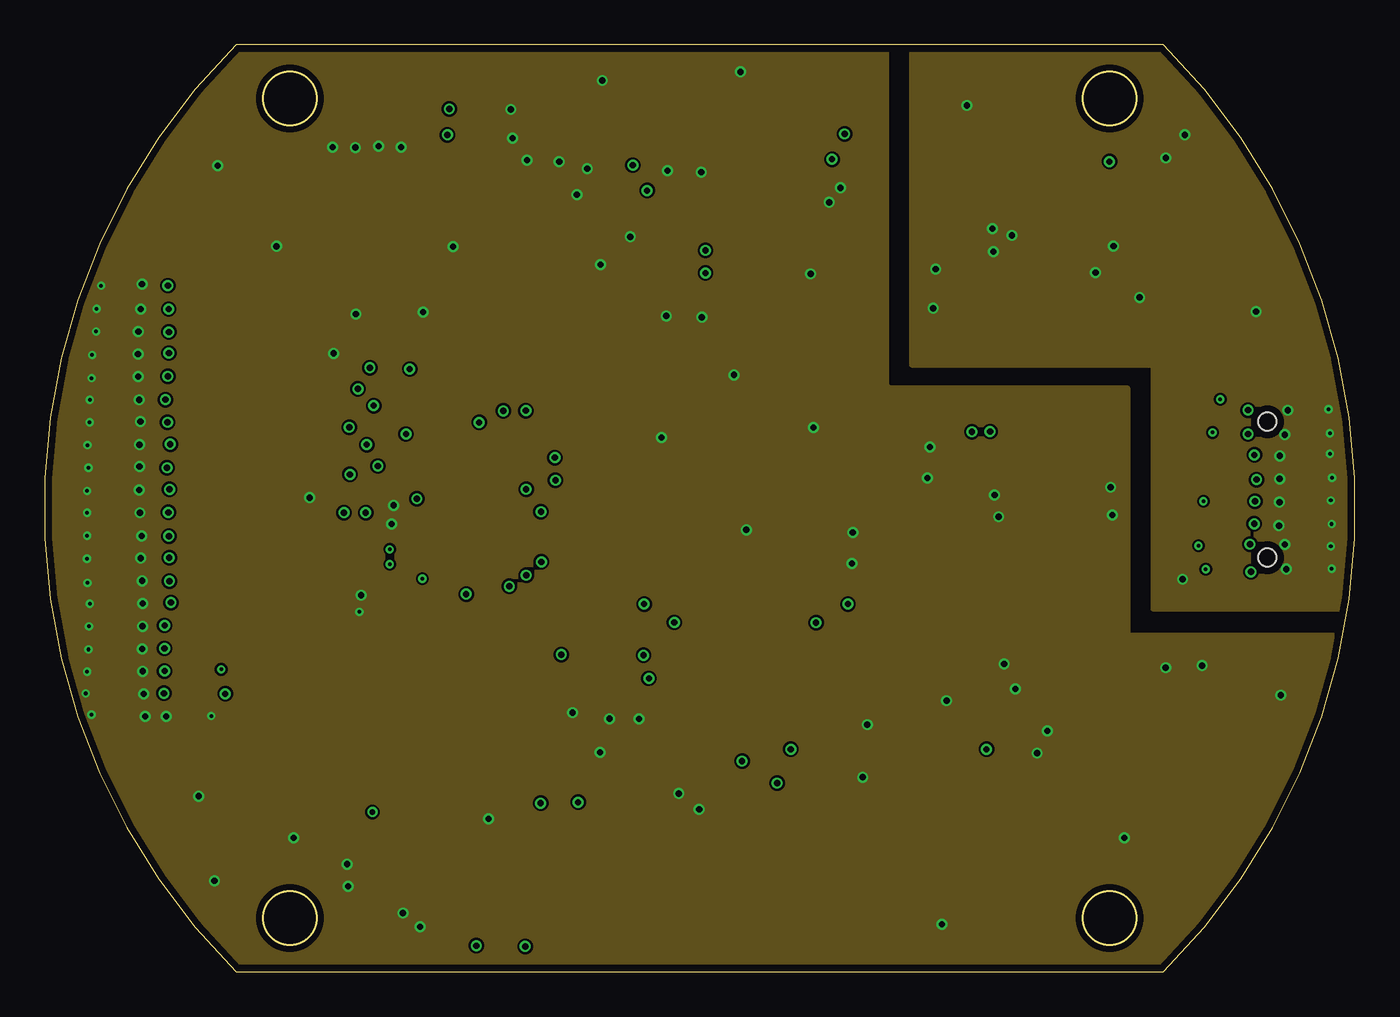
[diagram p5: board, inner layer Route15]
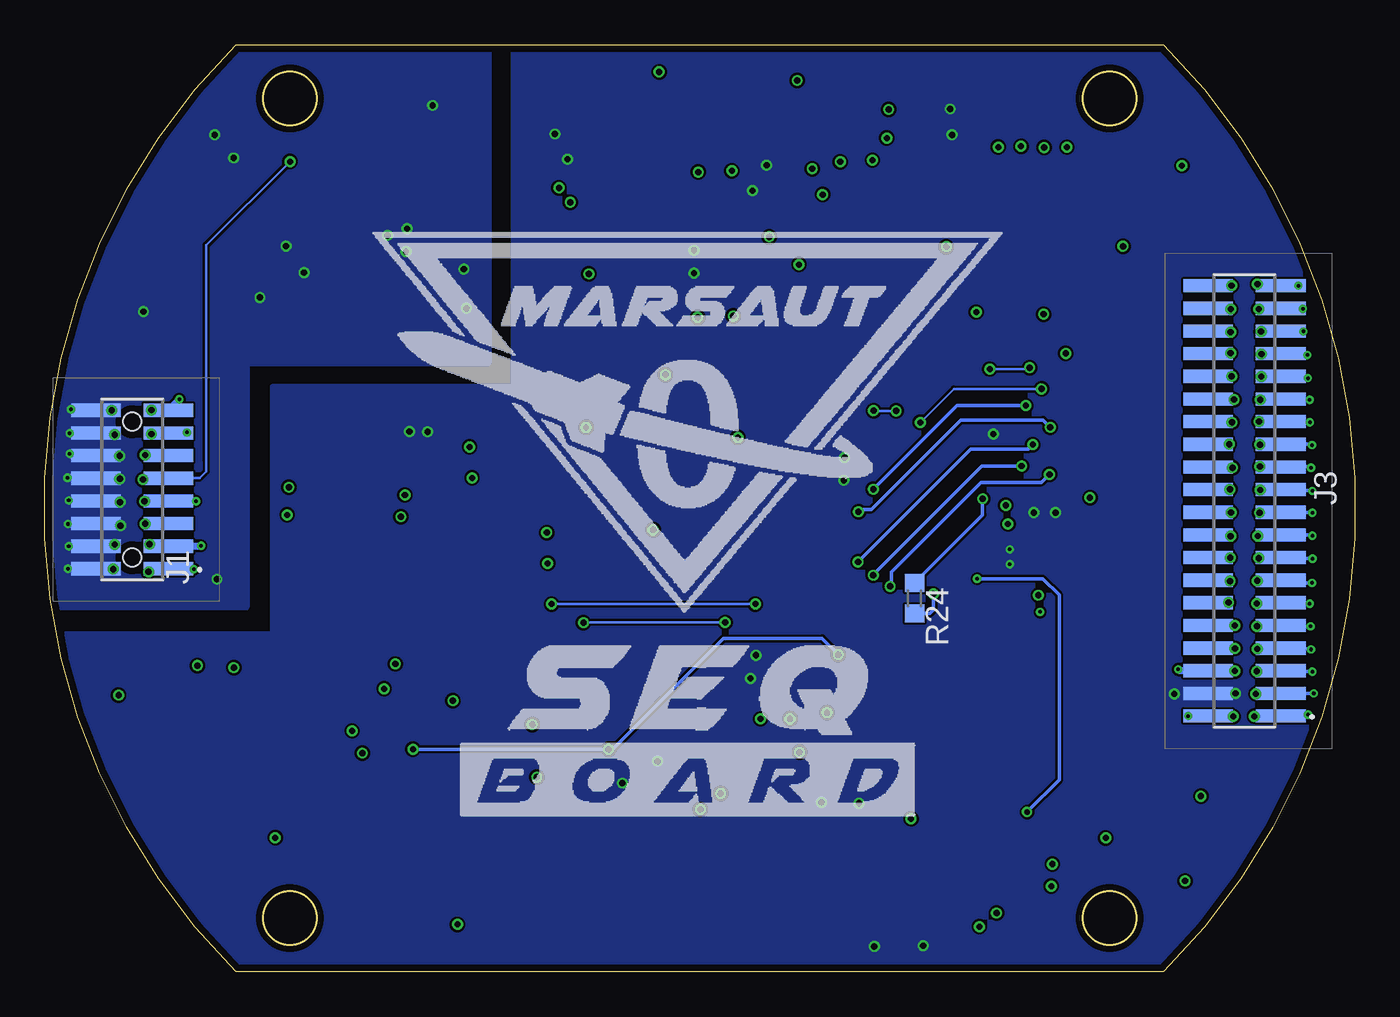
[diagram p6: board, bottom side, seen from below]

Size 73.46 x 52 mm. Coordinates in mm from the lower left corner, seen from the top.
Outline: 10.73,0 62.73,0 arc90 62.73,52 10.73,52 arc90 10.73,0
Outline: circle at 13.75,3.02 radius 1.5
Outline: circle at 59.71,48.98 radius 1.5
Outline: circle at 13.75,48.98 radius 1.5
Outline: circle at 59.71,3.02 radius 1.5
Copper layers (1+2*15+16): Top 0.035mm / dielectric 0.1mm / Route2 0.0175mm / dielectric 1.265mm / Route15 0.0175mm / dielectric 0.1mm / Bottom 0.035mm
Design rules "Marsaut0": minimum track width 3.5mil, minimum drill 0.2mm, track to track 4mil, track to pad 0.2mm, pad to pad 5mil, via to via 0.5mm, smd to smd 5mil, copper to edge 0.4mm, drill to drill 0.5mm, minimum pad ring 0.3mm, minimum via ring 0.13mm, stop-mask expansion 4mil, vias tented up to drill 0mil, thermal gap 10mil

### Footprints (pad centres in the part's own frame; a part is rotated, then mirrored left to right if it is on the bottom)
C0805K = smd 1.3 x 1.6: 1 -1,0; 2 1,0
C0805 = smd 1.3 x 1.5: 1 -0.95,0; 2 0.95,0
BROADCOM_ASMT-RF45-AN002_0 = smd 0.8 x 0.8: 1 -0.75,0; 2 0.75,0
SODFL3616X98N = smd 1.24 x 1.12: 1 -1.5,0; 2 1.5,0
BROADCOM_HSMA-C190_0 = smd 0.8 x 0.8: 1 -0.75,0; 2 0.75,0
BROADCOM_HSMH-C170_0 = smd 1.2 x 1.2: 1 -1.05,0; 2 1.05,0
TDK_MMZ1608S601ATA00_0 = smd 0.6 x 0.8: 1 -0.7,0; 2 0.7,0
FTSH-108-XX-YYY-DV-A = smd 0.74 x 2.79: 1 -4.445,-2.035; 2 -4.445,2.035; 3 -3.175,-2.035; 4 -3.175,2.035; 5 -1.905,-2.035; 6 -1.905,2.035; 7 -0.635,-2.035; 8 -0.635,2.035; 9 0.635,-2.035; 10 0.635,2.035; 11 1.905,-2.035; 12 1.905,2.035; 13 3.175,-2.035; 14 3.175,2.035; 15 4.445,-2.035; 16 4.445,2.035 | hole 1.02: -3.81,0; 3.81,0
FLE-108-01-XX-DV = smd 0.737 x 1.676: 1 -4.445,1.841; 2 -4.445,-1.841; 3 -3.175,1.841; 4 -3.175,-1.841; 5 -1.905,1.841; 6 -1.905,-1.841; 7 -0.635,1.841; 8 -0.635,-1.841; 9 0.635,1.841; 10 0.635,-1.841; 11 1.905,1.841; 12 1.905,-1.841; 13 3.175,1.841; 14 3.175,-1.841; 15 4.445,1.841; 16 4.445,-1.841
FTSH-120-XX-YYY-DV = smd 0.74 x 2.79: 1 -12.065,-2.035; 2 -12.065,2.035; 3 -10.795,-2.035; 4 -10.795,2.035; 5 -9.525,-2.035; 6 -9.525,2.035; 7 -8.255,-2.035; 8 -8.255,2.035; 9 -6.985,-2.035; 10 -6.985,2.035; 11 -5.715,-2.035; 12 -5.715,2.035; 13 -4.445,-2.035; 14 -4.445,2.035; 15 -3.175,-2.035; 16 -3.175,2.035; 17 -1.905,-2.035; 18 -1.905,2.035; 19 -0.635,-2.035; 20 -0.635,2.035; 21 0.635,-2.035; 22 0.635,2.035; 23 1.905,-2.035; 24 1.905,2.035; 25 3.175,-2.035; 26 3.175,2.035; 27 4.445,-2.035; 28 4.445,2.035; 29 5.715,-2.035; 30 5.715,2.035; 31 6.985,-2.035; 32 6.985,2.035; 33 8.255,-2.035; 34 8.255,2.035; 35 9.525,-2.035; 36 9.525,2.035; 37 10.795,-2.035; 38 10.795,2.035; 39 12.065,-2.035; 40 12.065,2.035
FLE-120-01-XX-DV = smd 0.737 x 1.676: 1 -12.065,1.841; 2 -12.065,-1.841; 3 -10.795,1.841; 4 -10.795,-1.841; 5 -9.525,1.841; 6 -9.525,-1.841; 7 -8.255,1.841; 8 -8.255,-1.841; 9 -6.985,1.841; 10 -6.985,-1.841; 11 -5.715,1.841; 12 -5.715,-1.841; 13 -4.445,1.841; 14 -4.445,-1.841; 15 -3.175,1.841; 16 -3.175,-1.841; 17 -1.905,1.841; 18 -1.905,-1.841; 19 -0.635,1.841; 20 -0.635,-1.841; 21 0.635,1.841; 22 0.635,-1.841; 23 1.905,1.841; 24 1.905,-1.841; 25 3.175,1.841; 26 3.175,-1.841; 27 4.445,1.841; 28 4.445,-1.841; 29 5.715,1.841; 30 5.715,-1.841; 31 6.985,1.841; 32 6.985,-1.841; 33 8.255,1.841; 34 8.255,-1.841; 35 9.525,1.841; 36 9.525,-1.841; 37 10.795,1.841; 38 10.795,-1.841; 39 12.065,1.841; 40 12.065,-1.841
SAMTEC-TSM-103-01-X-DH = smd 1.27 x 3.18: 1 -2.54,4.496; 2 -2.54,8.306; 3 0,4.496; 4 0,8.306; 5 2.54,4.496; 6 2.54,8.306
CUI_CSS-0575A-SMT = smd 2.1 x 1.7: 1 -1.9,-1.75; 2 1.9,-1.75; 3 -1.9,1.75
SOT95P237X111-3N = smd 1.43 x 0.6: 1 -0.96,0.95; 2 -0.96,-0.95; 3 0.96,0
R0603 = smd 1 x 1.1: 1 -0.85,0; 2 0.85,0
SW_147873-1 = smd 2.8 x 2.2: 1 -2.4,0; 2 2.4,0
QFP80P900X900X160-32N = smd 1.5 x 0.55: 1 -4.2,2.8; 2 -4.2,2; 3 -4.2,1.2; 4 -4.2,0.4; 5 -4.2,-0.4; 6 -4.2,-1.2; 7 -4.2,-2; 8 -4.2,-2.8; 17 4.2,-2.8; 18 4.2,-2; 19 4.2,-1.2; 20 4.2,-0.4; 21 4.2,0.4; 22 4.2,1.2; 23 4.2,2; 24 4.2,2.8 | smd 0.55 x 1.5: 9 -2.8,-4.2; 10 -2,-4.2; 11 -1.2,-4.2; 12 -0.4,-4.2; 13 0.4,-4.2; 14 1.2,-4.2; 15 2,-4.2; 16 2.8,-4.2; 25 2.8,4.2; 26 2,4.2; 27 1.2,4.2; 28 0.4,4.2; 29 -0.4,4.2; 30 -1.2,4.2; 31 -2,4.2; 32 -2.8,4.2
RI_8_1_ADI = smd 1.461 x 0.561: 1 -4.88,1.905; 2 -4.88,0.635; 3 -4.88,-0.635; 4 -4.88,-1.905; 5 4.88,-1.905; 6 4.88,-0.635; 7 4.88,0.635; 8 4.88,1.905
SOIC127P1032X265-16N = smd 2.05 x 0.59: 1 -4.655,4.445; 2 -4.655,3.175; 3 -4.655,1.905; 4 -4.655,0.635; 5 -4.655,-0.635; 6 -4.655,-1.905; 7 -4.655,-3.175; 8 -4.655,-4.445; 9 4.655,-4.445; 10 4.655,-3.175; 11 4.655,-1.905; 12 4.655,-0.635; 13 4.655,0.635; 14 4.655,1.905; 15 4.655,3.175; 16 4.655,4.445
QFN50P400X400X95-24N = smd 0.79 x 0.26: 1 -1.97,1.25; 2 -1.97,0.75; 3 -1.97,0.25; 4 -1.97,-0.25; 5 -1.97,-0.75; 6 -1.97,-1.25; 13 1.97,-1.25; 14 1.97,-0.75; 15 1.97,-0.25; 16 1.97,0.25; 17 1.97,0.75; 18 1.97,1.25 | smd 0.26 x 0.79: 7 -1.25,-1.97; 8 -0.75,-1.97; 9 -0.25,-1.97; 10 0.25,-1.97; 11 0.75,-1.97; 12 1.25,-1.97; 19 1.25,1.97; 20 0.75,1.97; 21 0.25,1.97; 22 -0.25,1.97; 23 -0.75,1.97; 24 -1.25,1.97

### Placement (x,y rotation side)
C1  32.76,15.93 270 top
C2  20.4,24.31 90 top
C3  19.5,20.49 180 top
C4  58.01,12.61 180 top
C6  51.49,28.65 180 top
C7  51.37,38.26 180 top
C8  24.39,47.57 0 top
C9  31.87,44.22 0 top
C10  35.84,38.72 90 top
C11  28.01,43.69 270 top
C12  35.85,43.01 270 top
D1  43.23,44.04 180 top
D2  25.56,2.97 90 top
D3  36.67,10.49 90 top
D4  55.9,17.04 0 top
D5  47.47,23.75 0 top
D6  63.93,44.75 270 top
D7  52.47,42.62 180 top
FB2  17.41,24.45 90 top
J1  68.55,27.05 90 bottom
J2  68.55,27.05 90 top
J3  6.19,26.42 90 bottom
J5  6.19,26.42 90 top
J6  42.43,7.98 0 top
LS1  30.71,6.45 270 top
Q2  22.29,4.34 0 top
R1  59.97,10.14 180 top
R2  22.85,26.52 0 top
R5  43.28,46.34 180 top
R6  36.66,14.35 270 top
R7  19.5,7.59 0 top
R8  21.83,29.74 180 top
R9  27.2,28.27 0 top
R10  58.25,26.39 180 top
R11  47.69,21.79 0 top
R12  52.96,44.54 180 top
R13  61.48,43.64 0 top
R14  55.94,18.9 0 top
R15  55.01,26.41 0 top
R16  55.08,40.44 0 top
R17  58.39,40.41 180 top
R18  55.22,23.51 90 top
R19  57.42,23.51 90 top
R20  55.57,43.41 90 top
R21  57.79,43.38 90 top
R22  22.76,32.36 270 top
R23  25.54,33.21 0 top
R24  24.69,20.96 270 bottom
R25  27.55,38.26 90 top
R26  29.6,36.18 90 top
R27  18.69,5.48 0 top
SW2  63.86,13.07 270 top
U2  26.63,20.13 0 top
U4  56.8,33.4 90 top
U5  20.63,40.3 270 top
U6  31.92,40.47 90 top

### Tracks (layer width: path | path; a pad name or v marks a point on that pad's centre or on a via)
1WIRE  (via drill 0.2, 0.35)
  Top 0.2: J2.7 67.84,26.42 v67.86,26.39
  Top 0.4: v67.86,26.39 v64.97,26.39
  Bottom 0.2: v67.86,26.39 66.54,26.39 J1.7
  Bottom 0.4: v64.97,26.39 v67.85,26.39 v67.86,26.39
3V  (via drill 0.2, 0.35)
  Top 0.2: J2.15 v67.47,31.5
  Top 0.4: v65.91,32.11 J1.15 v67.47,31.5
  Bottom 0.4: J1.15 v65.91,32.1 v65.91,32.11
+3V3  (via drill 0.2, 0.35)
  Top 0.2: v19.35,22.86 19.95,22.86 C2.1 20.01,23.7 v19.35,23.7
  Top 0.305: C9.2 33.26,43.79 33.78,43.79 v33.78,43.81 | v37.05,39.19 36.32,39.19 C10.2 36.63,40.46 v37.05,40.46 | R5.1 44.79,46.99 v44.85,46.99 | C1.1 33.23,16.46 v33.88,16.46 | J6.1 41.07,11.31 v41.07,10.59 | D2.1 v24.2,1.47 | C6.1 53.01,29.21 v53.01,30.3 | C2.1 19.8,23.31 | v16.79,25.76 17.39,25.15 FB2.2 18,25.75 v18,25.76
  Top 0.4: U6.13 33.17,43.88 C9.2 32.98,44.38 v32.98,45.24 | U6.9 U6.8 35.79,39.72 C10.2 36.26,40.09 | U4.1 52.57,28.52 C6.1 51.99,29.1 v51.99,30.29 | C8.1 23.81,47.2 U5.2 | U2.1 20.78,22.93 C2.1 20.04,23.31 | U2.17 32.36,17.33 C1.1 v33.59,17.75 v33.59,17.76 v33.58,17.76 | 28.93,8.37 LS1.1 | v6.7,15.62 J5.4 10.1,15.62 | v6.7,15.62 | v6.7,15.62 v6.69,15.62 | v6.69,15.62 | R5.1 v44.13,45.57 v44.14,45.56 v44.15,45.57 | C8.1 23.22,47.57 v22.58,46.94 | C8.1 22.74,48.27 22.74,48.39 v22.69,48.39 | v28.61,28.84 28.61,28.83 R9.2 28.61,27.71 28.61,27.59 28.63,27.57 v28.64,27.57 | R8.2 20.68,29.74 v20.26,30.16 | J6.1 39.22,11.8 39.1,11.8 v39.1,11.82 | LS1.1 27.91,9.4 27.81,9.4 v27.81,9.46 | LS1.1 29.91,9.3 v29.91,9.52 | D2.1 26.91,1.47 v26.95,1.43 | 10.1,15.62 | 10.1,15.62 v10.13,15.6
  Bottom 0.4: v6.69,15.62 J3.4
  pour Bottom (no thermals): 47.13,54.33 47.14,54.31 47.14,32.77 60.65,32.77 60.65,18.9 73.88,18.9 74.06,18.72 74.06,-1.94 73.96,-2.05 -2.27,-2.05 -2.26,-2.04 -2.26,54.3 5.64,54.3 5.71,54.37
+3V3_APU  (via drill 0.2, 0.35)
  Top 0.4: U4.8 54.87,38.26 C7.1 54.62,35.96 61.81,35.96 63.46,34.31 63.46,26 64.31,25.15 J2.5 | J2.5 J2.3 | J2.3 J2.1 65.12,22.61 v65.1,22.58 | J2.5 66.73,25.13 v67.81,25.13 | J2.3 67.47,23.88 v67.58,23.98 67.49,23.9 v64.69,23.9
  Bottom 0.4: v67.81,25.13 66.53,25.13 J1.5 | J1.1 67.47,22.61 v67.63,22.44 67.49,22.58 v65.1,22.58 | J1.3 64.72,23.88 v64.69,23.9
BAT_MOTOR_9V  (via drill 0.2, 0.35)
  Top 0.4: J5.6 6.75,16.89 v6.73,16.87 v6.73,16.88 | v6.73,16.88 | v9.9,16.97 9.81,16.88 v6.73,16.88
  Bottom 0.4: J3.6 9.83,16.89 v9.9,16.97
CURRENT_SENS_M1  (via drill 0.35)
  Top 0.2: U2.15 28.65,15.9 28.65,14.17 25.17,10.69 14.72,10.69 12,13.41 12,16.43 10.27,18.16 J5.8 6.74,18.16 v6.72,18.14
  Bottom 0.2: v6.72,18.14 8.21,18.14 J3.8
CURRENT_SENS_M2  (via drill 0.35)
  Top 0.2: U2.14 27.83,14.36 24.8,11.34 24.79,11.35 15.33,11.35 12.72,13.95 12.72,16.87 10.16,19.43 J5.10 v6.73,19.43
  Bottom 0.2: v6.73,19.43 J3.10
EN/DIA_M1  (via drill 0.35)
  Top 0.2: U2.10 24.63,14.82 24.34,14.54 16.5,14.54 14.9,16.13 14.9,17.99 13.01,19.88 13.01,21.66 10.14,24.53 7.06,24.53 v6.97,24.44 7.96,24.44 J5.18
  Bottom 0.2: v6.97,24.44 8.15,24.44 J3.18
EN/DIA_M2  (via drill 0.35)
  Top 0.2: U2.12 26.23,14.53 24.56,12.87 16.06,12.87 13.78,15.15 13.78,17.58 11.9,19.46 11.9,20.08 10.01,21.97 J5.14 7.04,21.97 7,21.93 v7,21.92
  Bottom 0.2: v7,21.92 8.17,21.92 J3.14
EN/DIB_M1  (via drill 0.35)
  Top 0.2: U2.11 25.43,14.61 24.57,13.76 16.34,13.76 14.3,15.79 14.3,17.84 12.43,19.71 12.43,20.71 9.9,23.24 J5.16 7,23.24 v6.99,23.23
  Bottom 0.2: J3.16 8.22,23.23 v6.99,23.23
EN/DIB_M2  (via drill 0.35)
  Top 0.2: U2.13 27.03,14.35 24.72,12.05 15.73,12.05 13.26,14.52 13.26,17.23 11.39,19.11 11.21,19.29 9.8,20.7 J5.12 7.1,20.7 v7.08,20.72
  Bottom 0.2: J3.12 7.1,20.7 v7.08,20.72
GATE
  Top 0.2: R7.2 20.35,7.13 19.54,6.32 R27.2 20.12,5.48 20.38,5.22 21.26,5.22 Q2.1
GND  (via drill 0.2, 0.35)
  Top 0.2: C1.2 32.76,14.75 v33.33,14.19 | J5.37 5.35,37.21 v5.39,37.17 5.38,37.19 v2.92,37.19 | J5.35 4.38,35.91 v5.26,35.91 2.9,35.91 v2.89,35.92 | J5.31 4.37,33.39 v5.25,33.39 5.16,33.3 v2.64,33.3 | J5.29 4.4,32.08 v5.31,32.08 v2.54,32.08 | J5.27 v5.37,30.86 v5.37,30.87 2.59,30.87 2.54,30.81 v2.52,30.82 | J5.25 5.29,29.59 v5.32,29.56 v5.32,29.57 2.43,29.57 v2.41,29.54 | J5.23 5.3,28.32 v5.32,28.34 2.53,28.34 v2.46,28.27 | J5.21 5.29,27.05 v5.31,27.03 5.26,26.98 v2.38,26.98 | J5.19 4.38,25.75 v5.35,25.75 v2.39,25.75 v2.38,25.76 | J5.17 4.42,24.45 v5.45,24.45 v5.43,24.46 v2.38,24.46 | J5.15 5.34,23.24 v5.37,23.2 v5.38,23.2 2.42,23.2 2.38,23.16 v2.37,23.18 | J5.13 4.39,21.93 v5.47,21.93 5.36,21.82 v2.41,21.82 | J5.11 4.39,20.66 v5.5,20.66 2.55,20.66 v2.54,20.65 | J5.9 4.4,19.39 v5.49,19.39 v5.49,19.38 v2.49,19.38 | J5.7 4.4,18.11 v5.47,18.11 2.49,18.11 v2.46,18.09 | J5.5 4.38,16.86 v5.5,16.86 2.41,16.86 v2.38,16.84 | U6.1 30.67,39.17 v31.17,39.67 | v34.85,36.78 v34.85,36.79 C10.1 36.85,36.76 v36.85,36.71 | v36.81,44.85 36.75,44.85 C12.1 34.93,44.88 v34.93,44.93 | v19.57,26.17 20.4,25.34 C2.2 20.79,25.31 | R2.1 20.79,25.31 | U2.32 22.84,25.31 20.79,25.31 | v17.75,21.12 17.87,21.12 C3.2 18.21,20.19 v17.65,20.19 | v17.02,4.81 17.16,4.81 R27.1 17.53,5.48 v16.96,6.04 | v20.09,3.3 21.24,3.3 Q2.2 21.05,3.11 v21.05,2.54 | D1.1 44.05,43.97 v44.62,43.97 | v53.79,17.27 54.02,17.04 D4.1 54.43,16.62 v54.43,15.88 | v45.26,22.91 46.1,23.75 D5.1 45.53,24.64 v45.31,24.64 | D3.1 36.67,9.14 v36.7,9.12 | U6.11 v32.85,41.22 v32.84,41.22 | J5.33 5.22,34.67 v5.24,34.65 2.72,34.65 v2.66,34.59 | U6.18 29.84,43.26 v29.84,43.59
  Top 0.2: C4.2 56.67,12.27 v55.65,12.27 | J5.39 v3.17,38.48 | v5.55,15.59 2.33,15.59 v2.31,15.62 | v2.63,14.43 5.54,14.43 v5.64,14.34 | J5.2 v9.34,14.35
  Top 0.305: C11.1 27.13,45.52 v27.05,45.52 | D1.1 43.98,43.17 v43.99,43.16 | C1.2 32.03,14.2 v31.67,14.2 | D3.1 35.82,9.74 v35.56,10.01 | J6.5 44.97,12.72 v46.12,13.87 | v53.26,26.75 53.59,26.41 R15.1 53.49,25.74 v53.49,25.53 | v59.76,27.18 59.1,26.52 R10.1 v59.86,25.63 | C2.2 19.64,25.31 v19.45,25.12
  Top 0.4: v5.55,15.59 4.38,15.59 J5.3 | v5.64,14.34 4.37,14.34 J5.1 | 6.85,14.35 v6.82,14.32 | v26.14,48.37 v26.13,48.37 C8.2 26.15,46.76 v26.24,46.76 | C11.1 28.8,45.43 v28.85,45.43 | v30.42,45.04 30.42,44.72 C9.1 30.29,43.59 v29.84,43.59 | U5.6 v18.73,46.29 v18.72,46.3 | U5.5 v20,46.25 v19.99,46.25 | U5.7 17.43,44.99 v17.43,46.23 | U5.8 16.15,45 v16.15,46.24 | U5.9 16.19,34.71 v16.21,34.68 | v17.45,36.88 v17.46,36.87 U5.10 U5.11 | U5.12 U5.13 21.23,35.69 v21.23,37 | J6.5 44.97,11.81 v45.86,10.92 | v49.49,27.7 49.59,27.7 C6.2 49.75,29.44 v49.63,29.44 | R10.1 59.18,26.47 58.71,26.95 U4.4 | v62.85,17.06 62.85,16.48 SW2.1 63.86,16.16 v64.89,17.19 v64.89,17.18 | C4.2 56.25,13.36 56.25,13.52 v56.22,13.52 | U2.16 29.43,14.71 v29.6,14.54
  Bottom 0.2: J3.35 5.23,35.94 v5.26,35.91 v5.25,35.92 v2.89,35.92 | J3.31 4.17,33.39 v5.25,33.39 2.73,33.39 v2.64,33.3 | J3.27 v5.37,30.86 v5.37,30.87 2.57,30.87 v2.52,30.82 | J3.23 5.31,28.32 v5.33,28.34 2.53,28.34 v2.46,28.27 | J3.19 5.32,25.78 v5.35,25.75 v5.34,25.76 v2.38,25.76 | J3.15 4.2,23.2 v5.38,23.2 5.36,23.18 v2.37,23.18 | J3.11 4.2,20.66 v5.5,20.66 5.49,20.65 v2.54,20.65 | J3.7 5.41,18.16 v5.46,18.11 v5.47,18.11 2.49,18.11 v2.46,18.09 | J3.5 5.47,16.89 v5.5,16.86 2.41,16.86 v2.38,16.84 | J3.39 5.38,38.48 v5.47,38.56 3.25,38.56 v3.17,38.48 | J3.2 6.85,14.35 v6.82,14.32 9.32,14.32 v9.34,14.35 | J3.37 4.13,37.19 v2.92,37.19 | J3.33 3.13,34.67 3.06,34.74 2.81,34.74 v2.66,34.59 | J3.29 4.08,32.05 2.54,32.05 v2.54,32.08 | J3.25 2.46,29.59 v2.41,29.54 | J3.21 4.11,27 2.38,27 v2.38,26.98 | J3.17 2.43,24.51 v2.38,24.46 | J3.13 4.01,21.82 v2.41,21.82 | J3.9 4.08,19.36 2.51,19.36 v2.49,19.38 | v2.31,15.62 5.53,15.62 | v5.64,14.34 2.56,14.34 2.51,14.39 2.55,14.43 v2.63,14.43
  Bottom 0.4: J3.3 5.53,15.62 v5.55,15.59 | J3.1 5.63,14.35 v5.64,14.34
  other vias: 60.53,7.53 8.63,9.86 13.97,7.52 9.52,5.11 24.89,8.59 31.14,12.32 39.34,24.79 34.59,29.97 38.65,33.48 43.1,30.53 50.57,15.21 50.31,2.67 69.31,15.52 42.95,39.14 39.01,50.47 31.26,49.99 13,40.69 9.7,45.21 22.91,40.67 14.85,26.59
  pour Route15 (no thermals): 47.13,54.26 47.15,54.24 47.15,32.91 47.34,32.71 60.69,32.71 60.69,18.84 73.88,18.84 74.07,18.65 74.07,-2.01 74.03,-2.05 -2.26,-2.05 -2.26,54.28 4.81,54.28 5.62,54.31
  pour Route2 (no thermals): 47.13,54.26 47.15,54.24 47.15,32.71 60.68,32.71 60.68,18.84 73.88,18.84 74.07,18.65 74.07,-2.01 74.03,-2.05 -2.23,-2.05 -2.21,-2.03 -2.21,54.22 -2.27,54.28 5.7,54.28 5.72,54.31
  pour Top (no thermals): 47.11,54.33 47.13,54.31 47.13,32.78 60.63,32.78 60.63,18.91 73.86,18.91 74.05,18.72 74.05,-1.94 74,-1.98 -2.24,-1.98 -2.24,-1.98 -2.24,54.25 2.87,54.25 5.67,54.35 5.7,54.37
GND_APU  (via drill 0.2, 0.35)
  Top 0.2: J2.14 70.38,30.21 69.45,30.21 | 69.45,30.21 | 69.45,30.21 v69.53,30.13 | J2.12 69.27,28.96 v69.25,28.94 | v69.24,27.65 69.28,27.69 J2.10 | v69.23,26.34 69.31,26.42 J2.8 | v59.93,40.7 59.64,40.41 R17.1 58.92,40.08 v58.92,39.21 58.92,38.49 U4.5 | D7.1 53.52,42.07 v53.13,41.68 | D6.1 63.77,45.64 v62.86,45.64
  Top 0.305: R16.1 v54.23,41.3 | v54.23,41.3 v54.22,41.3 | D7.1 54.23,41.91 v54.23,41.3 | D6.1 v63.93,46.94
  Top 0.4: J2.6 69.32,25.15 v69.2,25.03 69.3,25.12 v72.16,25.12 | J2.2 70.37,22.59 v69.62,22.59 72.14,22.59 v72.16,22.61 | v49.96,39.4 49.96,38.72 C7.2 50.42,37.81 v49.82,37.22 | v53.2,40.4 54.19,40.4 R16.1 | J2.4 v72.11,23.88 | v72.11,26.44 72.01,26.34 v69.23,26.34 | v72.18,27.71 72.12,27.65 v69.24,27.65 | v69.25,28.94 69.37,29.06 v72.06,29.06 | v72.06,30.2 69.61,30.2 v69.53,30.13 | J2.16 71.95,31.5 71.98,31.52 v71.98,31.55
  Bottom 0.2: J1.16 v69.7,31.5 v69.69,31.49 | v69.25,28.94 69.27,28.96 J1.12
  Bottom 0.4: J1.6 69.33,25.15 69.31,25.12 | v72.11,23.88 J1.4 69.63,23.88 v69.54,23.97 | J1.2 v72.16,22.61 | v72.16,25.12 69.31,25.12 | 69.31,25.12 v69.21,25.02 | J1.8 70.61,26.44 v72.11,26.44 | J1.10 70.61,27.71 v72.18,27.71 | v72.06,29.06 71.94,28.94 v69.25,28.94 | J1.14 72.03,30.23 v72.06,30.2 | v71.98,31.55 71.92,31.49 v69.69,31.49
  other vias: 67.92,37.03 51.71,48.59 61.39,37.82 63.8,22.02
  pour Top (no thermals): 48.61,54.55 48.61,34.15 62.17,34.15 62.17,20.47 77.41,20.47 77.41,39.91 62.75,54.58 48.64,54.58
  pour Route2 (no thermals): 48.61,54.52 48.61,34.12 62.15,34.12 62.15,20.43 77.41,20.43 77.41,39.88 62.75,54.55 48.64,54.55
  pour Route15 (no thermals): 48.64,54.49 48.64,34.08 62.18,34.08 62.18,20.4 77.44,20.4 77.44,39.85 62.78,54.52 48.67,54.52
  pour Bottom (no thermals): 48.61,54.55 48.61,34.15 62.17,34.15 62.17,20.47 77.41,20.47 77.41,39.91 62.75,54.58 48.64,54.58
INA_M1  (via drill 0.35)
  Top 0.2: U2.6 18.1,18.93 18.09,18.92 17.76,18.92 15.61,21.07 15.61,24.18 10.15,29.64 8.09,29.64 J5.26 v7.05,29.59
  Bottom 0.2: J3.26 v7.05,29.59
INA_M2  (via drill 0.35)
  Top 0.2: U2.8 17.04,17.33 14.1,20.27 14.1,23.49 10.45,27.14 8.13,27.14 J5.22 v7,27.06
  Bottom 0.2: J3.22 8.22,27.06 v7,27.06
INB_M1  (via drill 0.35)
  Top 0.2: U2.7 17.53,18.13 14.89,20.77 14.89,23.77 10.25,28.41 7,28.41 v6.86,28.27 6.91,28.32 J5.24
  Bottom 0.2: v6.86,28.27 8.18,28.27 J3.24
INB_M2  (via drill 0.35)
  Top 0.2: U2.9 23.81,15.91 16.47,15.91 15.61,16.77 15.61,18.08 13.6,20.09 13.6,22.73 10.55,25.78 J5.20 7.02,25.78 6.97,25.73 v6.94,25.77 | v6.94,25.77
  Bottom 0.2: v6.94,25.77 8.22,25.77 J3.20
JACK  (via drill 0.35)
  Top 0.2: U2.18 29.83,18.13 26.33,21.63 v26.06,21.63 | v17.12,27.9 17.06,27.95 13.2,27.95 10.2,30.95 8.12,30.95 J5.28 6.93,30.86 v6.89,30.82
  Bottom 0.2: v26.06,21.63 26,21.69 26,22.43 20.98,27.45 17.57,27.45 v17.12,27.9 | v6.89,30.82 8.19,30.82 J3.28
MONITORING_ALIM_APU  (via drill 0.2, 0.35)
  Top 0.4: J2.13 65.5,30.23 v65.48,30.25
  Bottom 0.2: J1.13 67.41,30.23 v67.47,30.16
  Bottom 0.4: v65.48,30.25 67.38,30.25 v67.47,30.16
MONITORING_ALIM_MOTOR  (via drill 0.35)
  Top 0.2: U2.27 v27.83,25.8 v27.83,25.81 | v17.08,30.54 16.8,30.26 14.01,30.26 9.54,34.73 8.1,34.73 J5.34 7,34.67 v6.97,34.7
  Bottom 0.2: v27.83,25.81 27.7,25.93 27.09,25.93 22.08,30.95 17.49,30.95 v17.08,30.54 | v6.97,34.7 7,34.67 J3.34
MONITORING_ALIM_SEQ  (via drill 0.35)
  Top 0.2: U2.28 27,24.35 v27,27.07 | v18.45,31.75 13.6,31.75 9.38,35.98 8.07,35.98 J5.36 7.02,35.94 v6.97,35.88
  Bottom 0.2: v27,27.07 22.31,31.75 v18.45,31.75 | v6.97,35.88 7.02,35.94 J3.36
N$1
  Top 0.2: R14.2 56.79,17.21 D4.2
N$2
  Top 0.2: R11.2 48.54,23.73 D5.2
N$3
  Top 0.4: U2.5 22.02,19.73 22.01,19.72 21.27,19.72 C3.1 20.5,21.07 19.6,21.97 18.62,21.97 17.41,23.17 FB2.1
N$4
  Top 0.2: U2.31 24.63,25.59 R2.2
N$6
  Top 0.4: R1.1 61.14,9.82 63,9.82 SW2.2 63.36,10.18
N$7
  Top 0.2: R5.2 42.48,46.29 D1.2
N$8
  Top 0.2: D7.2 51.42,43.85 R12.2
N$9
  Top 0.2: D3.2 36.66,11.25 R6.2
N$10
  Top 0.2: R13.2 63.87,43.64 D6.2
N$12
  Top 0.147: R19.2 57.42,26.38 R10.2 57.4,28.49 U4.3
N$13
  Top 0.147: R18.2 55.22,24.81 55.87,25.46 R15.2 55.86,28.21 U4.2
N$14
  Top 0.147: U4.7 56.17,40.2 R16.2 55.93,42.21 R20.1
N$15
  Top 0.147: U4.6 57.44,40.3 R17.2 57.54,42.29 R21.1
N$16
  Top 0.2: R22.1 22.76,33.81 23.81,34.86 U5.15
N$17
  Top 0.2: R23.1 24.69,34 25.08,34.39 U5.16
N$18  (via drill 0.35)
  Top 0.2: v20.87,26.54 20.87,27.73 19.34,29.26 19.34,42.4 21.27,44.32 U5.4
  Bottom 0.2: R24.1 20.87,25.62 v20.87,26.54
N$19
  Top 0.147: U6.24 29.95,37.38 R26.2
N$20
  Top 0.2: U6.23 28.15,39.72 R25.2
N$21
  Top 0.2: C12.2 34.51,40.72 U6.10
N$22
  Top 0.2: U6.20 29.34,41.22 28.01,42.55 C11.2
N$57
  Top 0.2: Q2.3 24.12,4.34 24.5,4.72 25.46,4.72 25.64,4.55
  Top 0.4: LS1.2 26.86,4.55
  Top 0.406: 26.86,4.55 25.64,4.55 D2.2
NRST  (via drill 0.35)
  Top 0.2: 41.96,12.49 v41.83,12.49 J6.3 | U2.4 24.55,20.53 27.28,17.8 v28.97,17.8 | v52.8,12.49 54.99,14.67 58.07,14.67 59.01,13.73 C4.1
  Top 0.4: 59.11,10.14 R1.2 59.01,10.24 C4.1
  Bottom 0.2: v28.97,17.8 29.88,18.71 35.4,18.71 41.62,12.49 v41.83,12.49 v52.8,12.49
PWM_BUZZER  (via drill 0.2, 0.3)
  Top 0.2: v18.38,8.97 18.65,8.71 R7.1 | v21.18,22.05 21.26,22.13 U2.2
  Bottom 0.2: v18.38,8.97 16.58,10.78 16.58,21.13 17.5,22.05 v21.18,22.05
PWM_M1  (via drill 0.35)
  Top 0.2: U2.21 28.76,20.53 27.2,22.08 27.17,22.08 v27,22.25 | v18.68,28.37 18.35,28.71 13.43,28.71 9.94,32.19 8.1,32.19 J5.30 6.82,32.13 v6.78,32.09
  Bottom 0.2: v27,22.25 27,22.28 20.91,28.37 v18.68,28.37 | v6.78,32.09 8.19,32.09 J3.30
PWM_M2  (via drill 0.35)
  Top 0.2: U2.22 29.52,21.33 v27.85,22.99 | v18.06,29.57 17.92,29.43 13.74,29.43 9.77,33.4 8.28,33.4 8.16,33.27 J5.32 v6.92,33.4 v6.91,33.4
  Bottom 0.2: v27.85,22.99 21.53,29.31 18.31,29.31 v18.06,29.57 | v6.91,33.4 J3.32
RST_DS  (via drill 0.35)
  Top 0.2: v23.64,21.19 22.57,21.19 U2.3
  Bottom 0.2: v23.64,21.19 23.64,20.29 23.82,20.11 R24.2
RX_APU  (via drill 0.35)
  Top 0.147: 58.88,43.13 60.13,43.13 R13.1 | 65.02,29.12 65.19,28.96 J2.11
  Top 0.152: R21.2 58.88,43.13 64.71,37.31 64.71,29.43 65.02,29.12
  Top 0.2: v67.83,28.99 67.79,28.96 J2.11
  Bottom 0.2: J1.11 66.55,28.99 v67.83,28.99
RX_SEQ  (via drill 0.35)
  Top 0.147: R18.1 53.19,20.63 46.12,20.63 | 46.12,20.63 v45.04,20.63 | 46.12,20.63 46.84,21.35 R11.1 | v33.61,20.63 32.7,19.73 U2.20
  Bottom 0.147: v33.61,20.63 v33.62,20.63 v45.04,20.63
SCL  (via drill 0.35)
  Top 0.147: U2.29 26.23,28.14 R9.1 | R9.1 26.35,33.17 R23.2 | R9.1 26.35,28.83 v24.36,30.81 | v17.57,32.69 14.12,32.69 9.52,37.29 8.11,37.29
  Top 0.152: R23.2 27.55,34.37 R25.1
  Top 0.2: v6.96,37.17 7,37.21 J5.38 8.11,37.29
  Bottom 0.147: v24.36,30.81 22.48,32.69 v17.57,32.69
  Bottom 0.2: J3.38 8.19,37.17 v6.96,37.17
SDA  (via drill 0.35)
  Top 0.147: U2.30 25.43,26.99 R8.1 22.68,31.43 R22.2 | R22.2 25.67,31.51 v25.72,31.46 | R22.2 20.47,33.8 v20.47,33.81 | v18.23,33.88 14.45,33.88 9.8,38.53 8.08,38.53
  Top 0.152: v26.98,31.47 29.6,34.09 R26.1
  Top 0.2: v6.91,38.48 J5.40 8.08,38.53
  Bottom 0.147: v25.72,31.46 v26.97,31.46 v26.98,31.47 | v20.47,33.81 18.31,33.81 v18.23,33.88
  Bottom 0.2: v6.91,38.48 J3.40
SWCLK
  Top 0.147: U2.24 38.13,22.93 42.43,18.62 J6.4
SWDIO
  Top 0.152: U2.23 34.06,22.13 J6.2
  Top 0.2: J6.2 38.8,15.2 R6.1
TX_APU  (via drill 0.35)
  Top 0.147: R20.2 54.08,44.26 R12.1
  Top 0.152: R20.2 56.78,45.48 59.48,45.48 59.52,45.44 v59.7,45.44
  Top 0.2: J2.9 67.87,27.69 v67.94,27.61
  Bottom 0.147: 64.39,28.67 64.39,28.06 64.77,27.69 J1.9
  Bottom 0.152: v59.7,45.44 64.39,40.75 64.39,28.67
  Bottom 0.2: v67.94,27.61 66.59,27.61 J1.9
TX_SEQ  (via drill 0.35)
  Top 0.147: 57.4,22.66 R19.1 54.34,19.59 | U2.19 31.05,19.15 34.86,19.15 v35.31,19.6 | v43.25,19.59 54.34,19.59 | 54.34,19.59 55.03,18.89 R14.1
  Bottom 0.147: v35.31,19.6 43.24,19.6
  Bottom 0.2: 43.24,19.6 v43.25,19.59